# EAGLE schematic LAUNCHXL-F28069_B_1400922 (EAGLE 6.5.0)

## Sheet 1 of 7
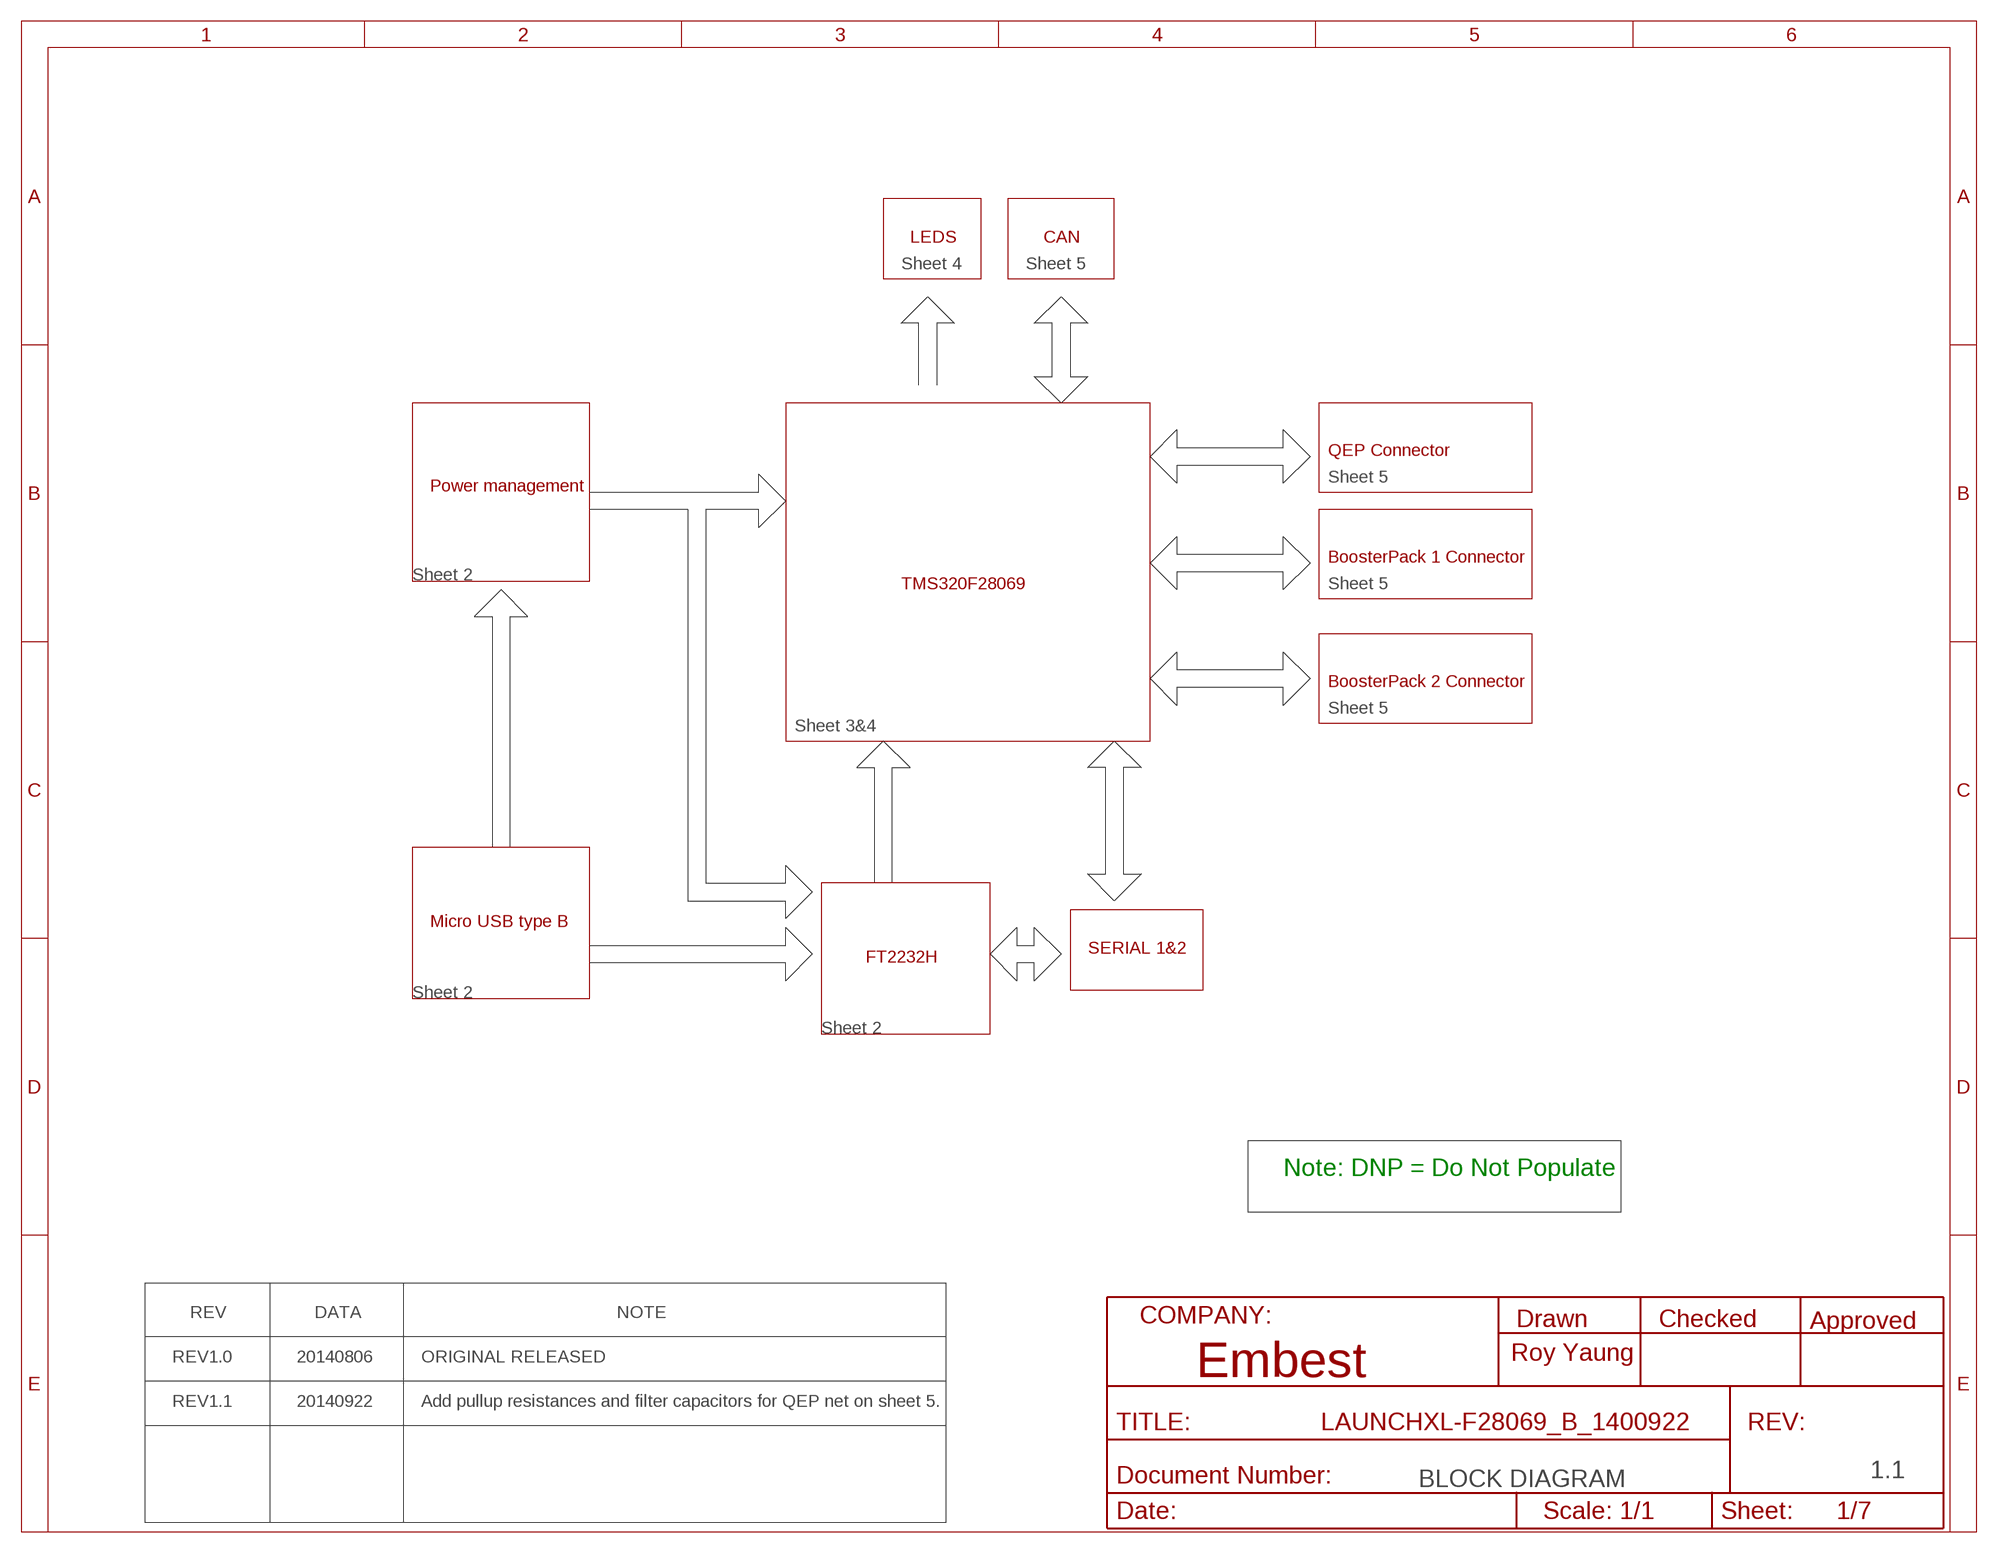
[diagram p0: schematic, sheet 1]

### Notes on the sheet
- LEDS | CAN
- Sheet 4 | Sheet 5
- QEP Connector
- Sheet 5
- Power management
- BoosterPack 1 Connector
- Sheet 2
- TMS320F28069 | Sheet 5
- BoosterPack 2 Connector
- Sheet 5
- Sheet 3&4
- Micro USB type B
- SERIAL 1&2
- FT2232H
- Sheet 2
- Sheet 2
- Note: DNP = Do Not Populate
- REV | DATA | NOTE
- REV1.0 | 20140806 | ORIGINAL RELEASED | Roy Yaung
- REV1.1 | 20140922 | Add pullup resistances and filter capacitors for QEP net on sheet 5.
- 1.1
- BLOCK DIAGRAM

## Sheet 2 of 7
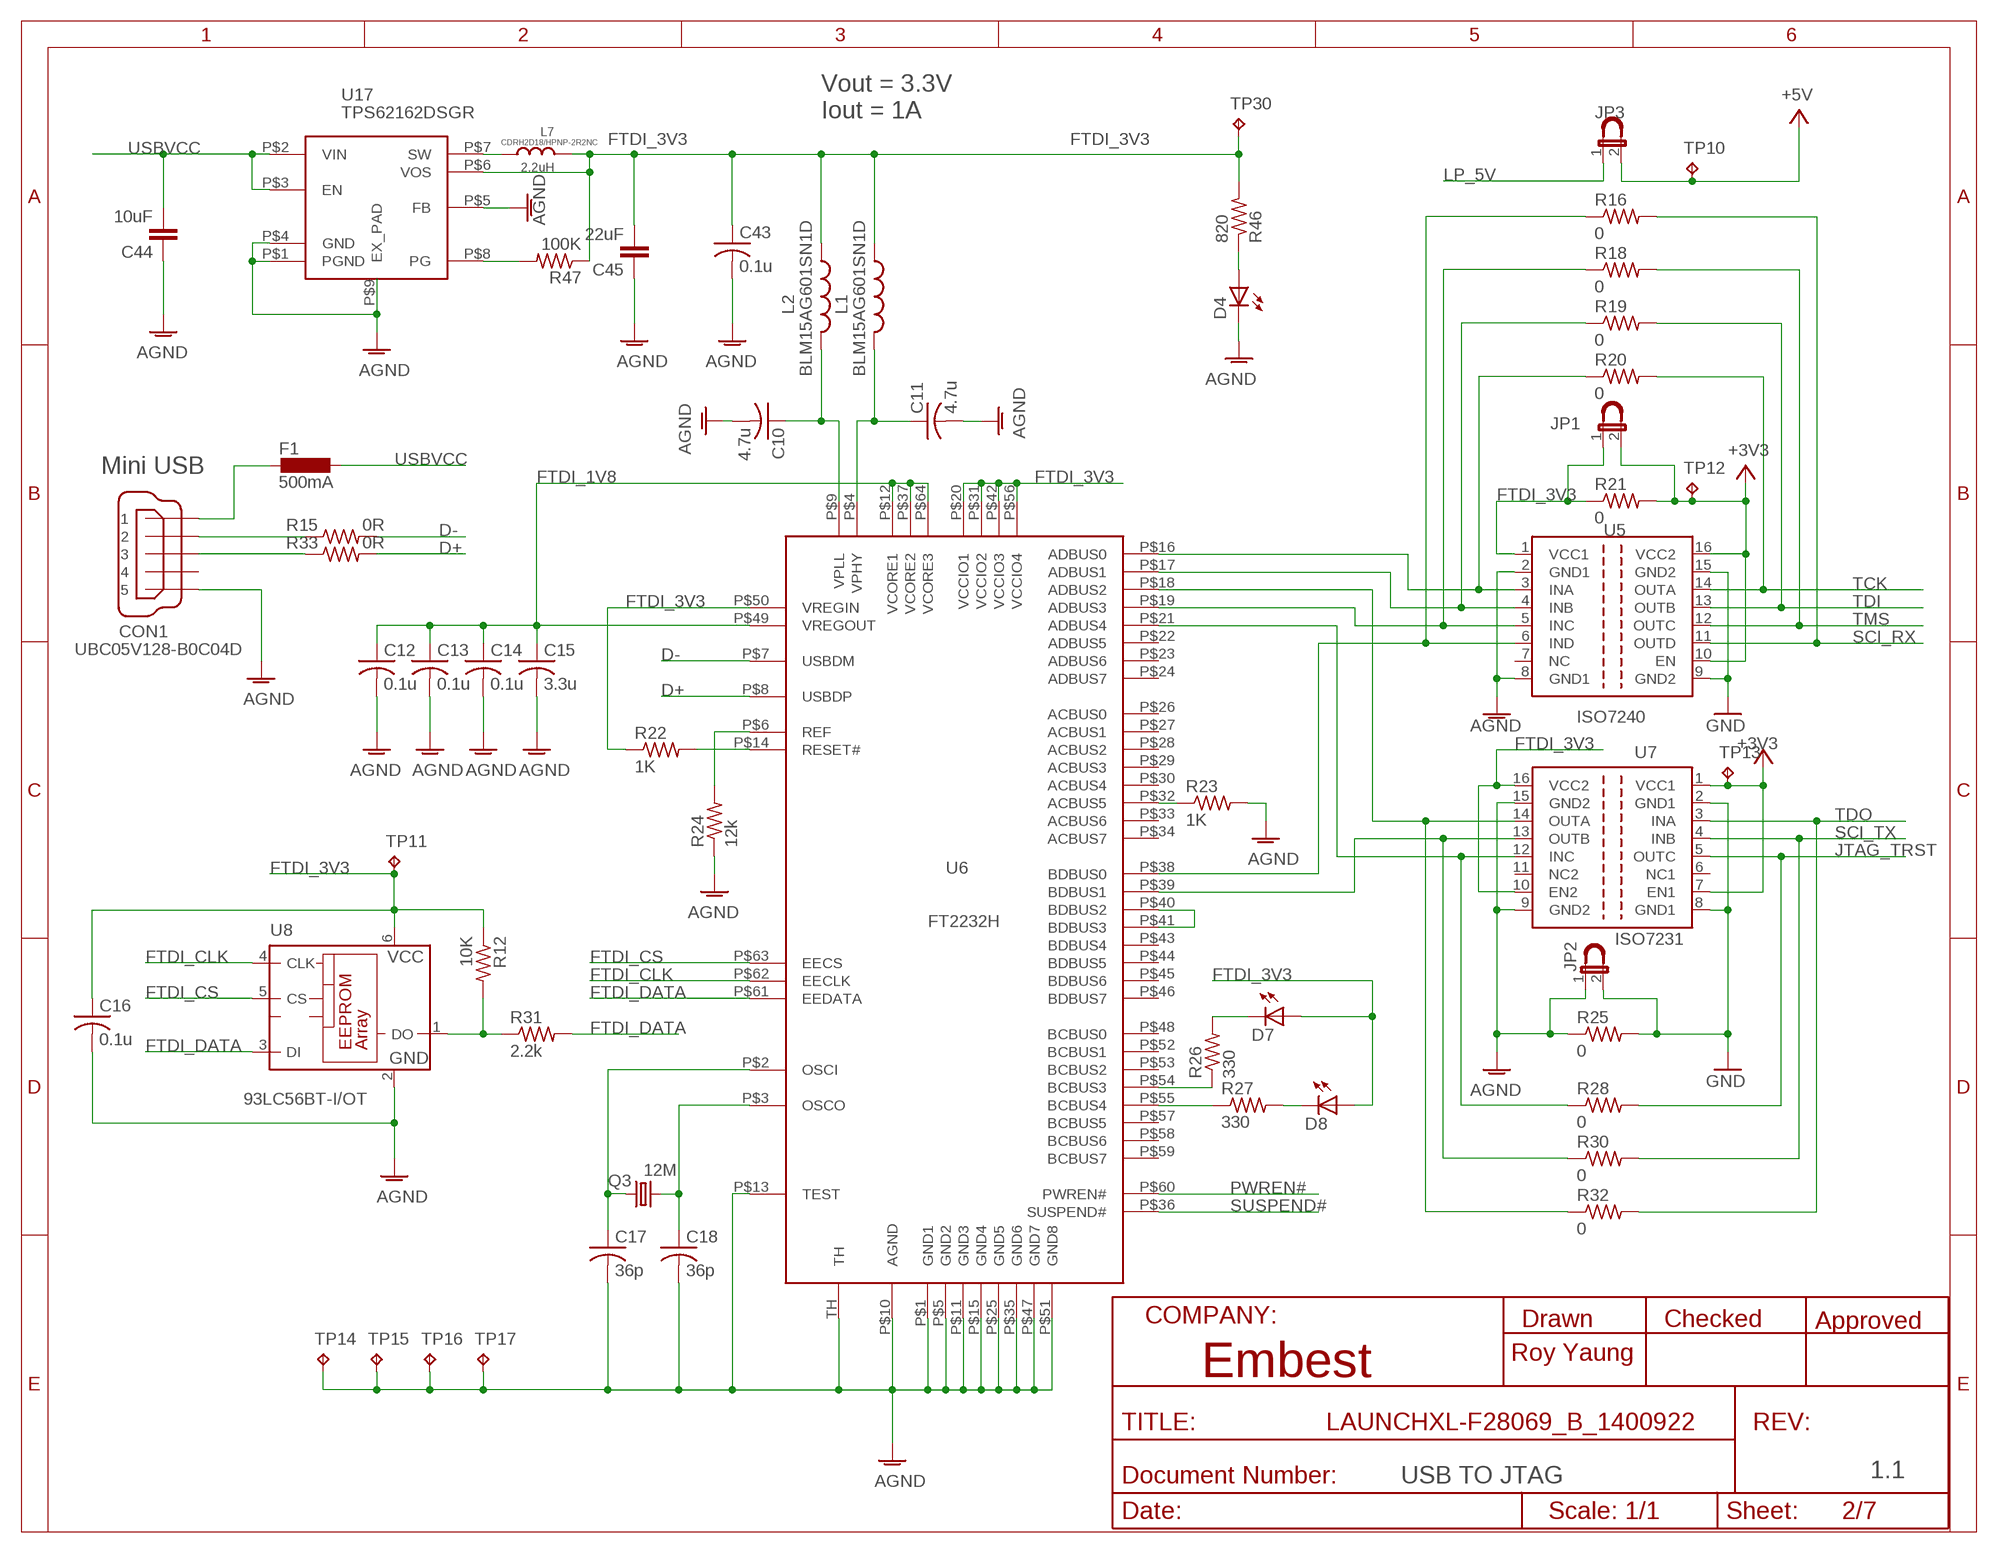
[diagram p1: schematic, sheet 2]

### Parts
C10  4.7u  C-USC0402  [C0402]
C11  4.7u  C-USC0402  [C0402]
C12  0.1u  C-USC0402  [C0402]
C13  0.1u  C-USC0402  [C0402]
C14  0.1u  C-USC0402  [C0402]
C15  3.3u  C-USC0402  [C0402]
C16  0.1u  C-USC0402  [C0402]
C17  36p  C-USC0402  [C0402]
C18  36p  C-USC0402  [C0402]
C43  0.1u  C-USC0402  [C0402]
C44  10uF  SPARKFUN_CAP1210  [SPARKFUN_1210]
C45  22uF  SPARKFUN_CAP1210  [SPARKFUN_1210]
CON1  UBC05V128-B0C04D  MINI-USB-32005-201  [32005-201]
D4  LEDCHIP-LED0603  [CHIP-LED0603]
D7  LEDCHIP-LED0603  [CHIP-LED0603]
D8  LEDCHIP-LED0603  [CHIP-LED0603]
F1  500mA  L-EUL1812  [L1812]
JP1  JP1ENORM  [JP1]
JP2  JP1ENORM  [JP1]
JP3  JP1ENORM  [JP1]
L1  BLM15AG601SN1D  L-US0402  [R0402]
L2  BLM15AG601SN1D  L-US0402  [R0402]
L7  2.2uH  VLF4012A`  [INDUCT-3.2*3.2]
Q3  12M  CRYSTALHC49UP  [HC49UP]
R12  10K  R-US_R0402  [R0402]
R15  0R  R-US_R0402  [R0402]
R16  0  R-US_R1206  [R1206]
R18  0  R-US_R1206  [R1206]
R19  0  R-US_R1206  [R1206]
R20  0  R-US_R1206  [R1206]
R21  0  R-US_R1206  [R1206]
R22  1K  R-US_R0402  [R0402]
R23  1K  R-US_R0402  [R0402]
R24  12k  R-US_R0402  [R0402]
R25  0  R-US_R1206  [R1206]
R26  330  R-US_R0402  [R0402]
R27  330  R-US_R0402  [R0402]
R28  0  R-US_R1206  [R1206]
R30  0  R-US_R1206  [R1206]
R31  2.2k  R-US_R0402  [R0402]
R32  0  R-US_R1206  [R1206]
R33  0R  R-US_R0402  [R0402]
R46  820  R-US_R0402  [R0402]
R47  100K  R-US_R0402  [R0402]
TP10  TESTPAD_TPB1,27  [TESTPAD_B1,27]
TP11  TESTPAD_TPB1,27  [TESTPAD_B1,27]
TP12  TESTPAD_TPB1,27  [TESTPAD_B1,27]
TP13  TESTPAD_TPB1,27  [TESTPAD_B1,27]
TP14  TESTPAD_TPB1,27  [TESTPAD_B1,27]
TP15  TESTPAD_TPB1,27  [TESTPAD_B1,27]
TP16  TESTPAD_TPB1,27  [TESTPAD_B1,27]
TP17  TESTPAD_TPB1,27  [TESTPAD_B1,27]
TP30  TESTPAD_TPB1,27  [TESTPAD_B1,27]
U5  ISO7240  [SO-16DW]
U6  FT2232H  [QFN64]
U7  ISO7231  [SO-16DW]
U8  93LC56BT-I/OT  93  [SOT23-6]
U17  TPS62162DSGR  [TI_DSG8]
U$9  ROY_JUMPER  [ROY_JUMPER]
U$10  ROY_JUMPER  [ROY_JUMPER]
U$11  ROY_JUMPER  [ROY_JUMPER]

### Nets
+3V3: JP1.2 R21.2 TP12.TP TP13.TP U5.10(EN) U5.16(VCC2) U7.1(VCC1) U7.7(EN1) ; also sheet 3,4,5,6,7
+5V: JP3.2 TP10.TP ; also sheet 5
AGND: C10.2 C11.2 C12.2 C13.2 C14.2 C15.2 C16.2 C17.2 C18.2 C43.2 C44.1 C45.1 CON1.5 D4.C JP2.1 R23.2 R24.1 R25.1 TP14.TP TP15.TP TP16.TP TP17.TP U5.2(GND1) U5.8(GND1) U6.P$1(GND1) U6.P$5(GND2) U6.P$10(AGND) U6.P$11(GND3) U6.P$13(TEST) U6.P$15(GND4) U6.P$25(GND5) U6.P$35(GND6) U6.P$47(GND7) U6.P$51(GND8) U6.TH U7.9(GND2) U7.15(GND2) U8.2(GND) U17.P$1(PGND) U17.P$4(GND) U17.P$5(FB) U17.P$9(EX_PAD)
D+: R33.2 U6.P$8(USBDP)
D-: R15.2 U6.P$7(USBDM)
FTDI_1V8: C12.1 C13.1 C14.1 C15.1 U6.P$12(VCORE1) U6.P$37(VCORE2) U6.P$49(VREGOUT) U6.P$64(VCORE3)
FTDI_3V3: C16.1 C43.1 C45.2 D7.A D8.A JP1.1 L1.1 L2.1 L7.P$1 R12.1 R21.1 R22.1 R46.2 R47.1 TP11.TP TP30.TP U5.1(VCC1) U6.P$20(VCCIO1) U6.P$31(VCCIO2) U6.P$42(VCCIO3) U6.P$50(VREGIN) U6.P$56(VCCIO4) U7.10(EN2) U7.16(VCC2) U8.6(VCC) U17.P$6(VOS)
FTDI_CLK: U6.P$62(EECLK) U8.4(CLK)
FTDI_CS: U6.P$63(EECS) U8.5(CS)
FTDI_DATA: R31.2 U6.P$61(EEDATA) U8.3(DI)
GND: JP2.2 R25.2 U5.9(GND2) U5.15(GND2) U7.2(GND1) U7.8(GND1) ; also sheet 3,4,5,6,7
JTAG_TRST: R28.2 U7.5(OUTC) ; also sheet 3
LP_5V: JP3.1 ; also sheet 7
N$1: R20.1 U5.3(INA) U6.P$16(ADBUS0)
N$2: C17.1 Q3.1 U6.P$2(OSCI)
N$4: R19.1 U5.4(INB) U6.P$17(ADBUS1)
N$5: R32.1 U6.P$18(ADBUS2) U7.14(OUTA)
N$6: R18.1 U5.5(INC) U6.P$19(ADBUS3)
N$7: C18.1 Q3.2 U6.P$3(OSCO)
N$12: R12.2 R31.1 U8.1(DO)
N$13: R28.1 U6.P$21(ADBUS4) U7.12(INC)
N$14: R23.1 U6.P$32(ACBUS5)
N$15: U6.P$40(BDBUS2) U6.P$41(BDBUS3)
N$16: R16.1 U5.6(IND) U6.P$38(BDBUS0)
N$17: R24.2 U6.P$6(REF)
N$19: R26.1 U6.P$54(BCBUS3)
N$20: C11.1 L1.2 U6.P$4(VPHY)
N$21: R30.1 U6.P$39(BDBUS1) U7.13(OUTB)
N$22: R27.1 U6.P$55(BCBUS4)
N$23: D7.C R26.2
N$24: D8.C R27.2
N$26: C10.1 L2.2 U6.P$9(VPLL)
N$34: R22.2 U6.P$14(RESET#)
N$38: CON1.2 R15.1
N$39: CON1.3 R33.1
N$40: D4.A R46.1
N$43: R47.2 U17.P$8(PG)
N$51: L7.P$2 U17.P$7(SW)
PWREN#: U6.P$60(PWREN#)
SCI_RX: R16.2 U5.11(OUTD) ; also sheet 6
SCI_TX: R30.2 U7.4(INB) ; also sheet 6
SUSPEND#: U6.P$36(SUSPEND#)
TCK: R20.2 U5.14(OUTA) ; also sheet 3
TDI: R19.2 U5.13(OUTB) ; also sheet 3
TDO: R32.2 U7.3(INA) ; also sheet 3
TMS: R18.2 U5.12(OUTC) ; also sheet 3
USBVCC: C44.2 F1.1 U17.P$2(VIN) U17.P$3(EN)
XUSB: CON1.1 F1.2
Unconnected: CON1.4 U5.7(NC) U6.P$22(ADBUS5) U6.P$23(ADBUS6) U6.P$24(ADBUS7) U6.P$26(ACBUS0) U6.P$27(ACBUS1) U6.P$28(ACBUS2) U6.P$29(ACBUS3) U6.P$30(ACBUS4) U6.P$33(ACBUS6) U6.P$34(ACBUS7) U6.P$43(BDBUS4) U6.P$44(BDBUS5) U6.P$45(BDBUS6) U6.P$46(BDBUS7) U6.P$48(BCBUS0) U6.P$52(BCBUS1) U6.P$53(BCBUS2) U6.P$57(BCBUS5) U6.P$58(BCBUS6) U6.P$59(BCBUS7) U7.6(NC1) U7.11(NC2)

### Notes on the sheet
- Vout = 3.3V
- Iout = 1A
- CDRH2D18/HPNP-2R2NC
- Mini USB
- Roy Yaung
- USB TO JTAG | 1.1

## Sheet 3 of 7
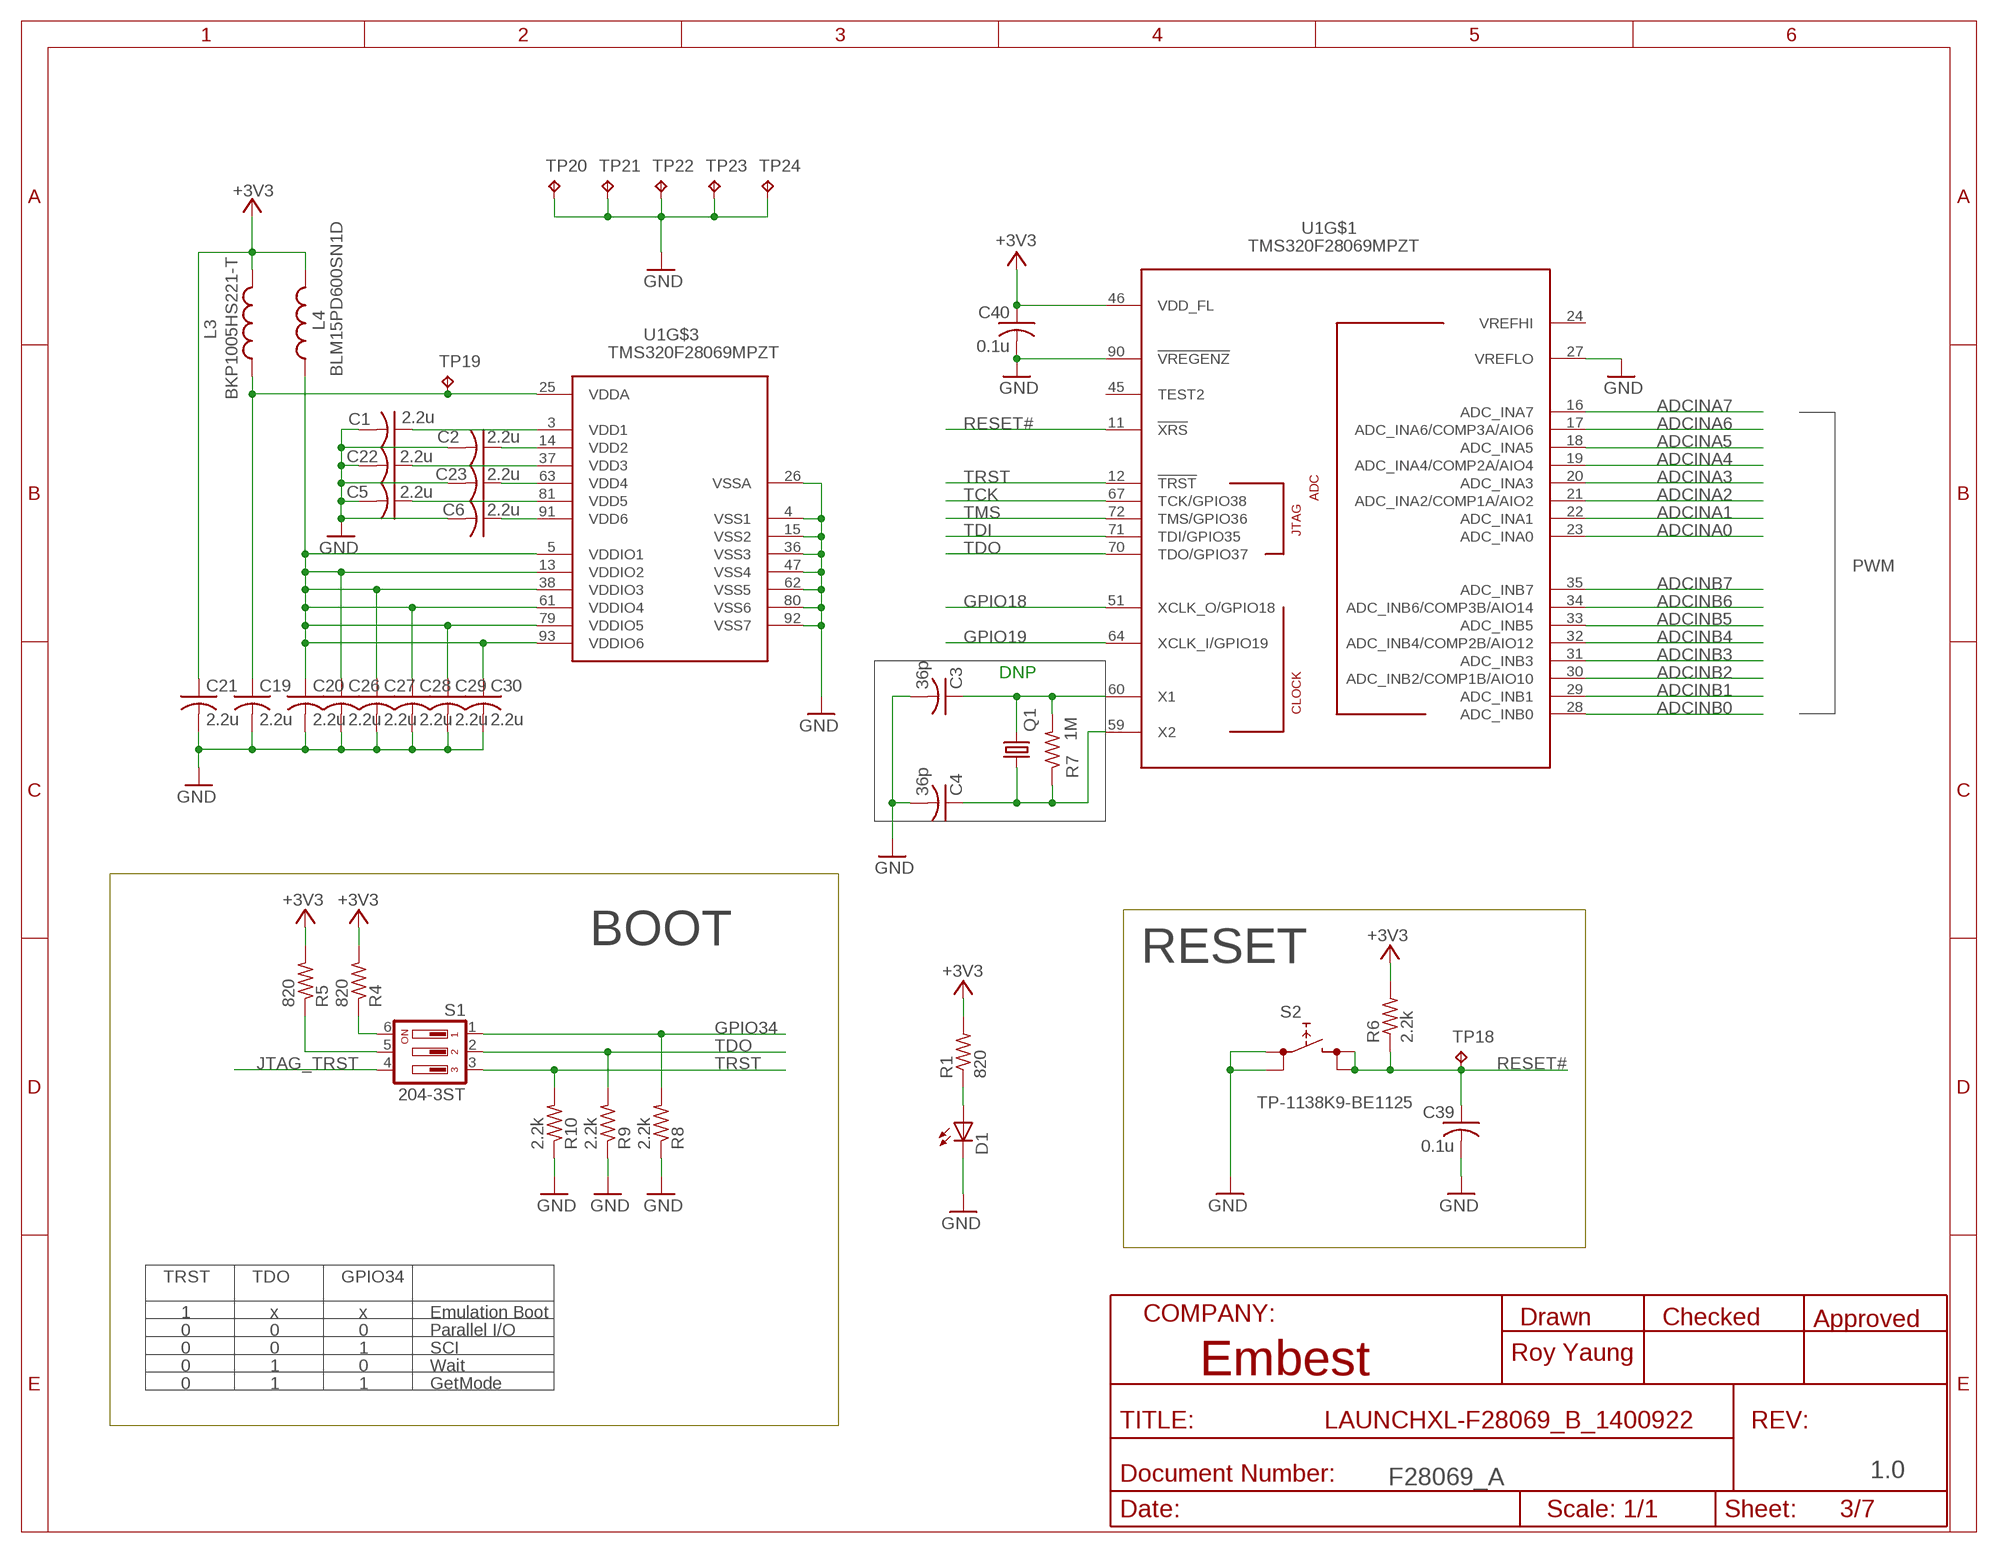
[diagram p2: schematic, sheet 3]

### Parts
C1  2.2u  C-USC0402  [C0402]
C2  2.2u  C-USC0402  [C0402]
C3  36p  C-USC0402  [C0402]
C4  36p  C-USC0402  [C0402]
C5  2.2u  C-USC0402  [C0402]
C6  2.2u  C-USC0402  [C0402]
C19  2.2u  C-USC0402  [C0402]
C20  2.2u  C-USC0402  [C0402]
C21  2.2u  C-USC0402  [C0402]
C22  2.2u  C-USC0402  [C0402]
C23  2.2u  C-USC0402  [C0402]
C26  2.2u  C-USC0402  [C0402]
C27  2.2u  C-USC0402  [C0402]
C28  2.2u  C-USC0402  [C0402]
C29  2.2u  C-USC0402  [C0402]
C30  2.2u  C-USC0402  [C0402]
C39  0.1u  C-USC0402  [C0402]
C40  0.1u  C-USC0402  [C0402]
D1  LEDCHIP-LED0603  [CHIP-LED0603]
L3  BKP1005HS221-T  L-US0402  [R0402]
L4  BLM15PD600SN1D  L-US0402  [R0402]
Q1  CRYSTALHC49S  [HC49/S]
R1  820  R-US_R0402  [R0402]
R4  820  R-US_R0402  [R0402]
R5  820  R-US_R0402  [R0402]
R6  2.2k  R-US_R0402  [R0402]
R7  1M  R-US_R0402  [R0402]
R8  2.2k  R-US_R0402  [R0402]
R9  2.2k  R-US_R0402  [R0402]
R10  2.2k  R-US_R0402  [R0402]
S1  204-3ST  219-03  [CTS-219-03]
S2  TP-1138K9-BE1125  FSMJSMA  [FSMJSMA]
TP18  TESTPAD_TPB1,27  [TESTPAD_B1,27]
TP19  TESTPAD_TPB1,27  [TESTPAD_B1,27]
TP20  TESTPAD_TPB1,27  [TESTPAD_B1,27]
TP21  TESTPAD_TPB1,27  [TESTPAD_B1,27]
TP22  TESTPAD_TPB1,27  [TESTPAD_B1,27]
TP23  TESTPAD_TPB1,27  [TESTPAD_B1,27]
TP24  TESTPAD_TPB1,27  [TESTPAD_B1,27]
U1  TMS320F28069MPZT  TMS320F28069PZSR  [PQFP100]

### Nets
+3V3: C21.1 C40.1 L3.2 L4.2 R1.2 R4.2 R5.2 R6.2 U1.46(VDD_FL) ; also sheet 2,4,5,6,7
ADCINA0: U1.23(ADC_INA0) ; also sheet 5
ADCINA1: U1.22(ADC_INA1) ; also sheet 5
ADCINA2: U1.21(ADC_INA2/COMP1A/AIO2) ; also sheet 5
ADCINA3: U1.20(ADC_INA3) ; also sheet 5
ADCINA4: U1.19(ADC_INA4/COMP2A/AIO4) ; also sheet 5
ADCINA5: U1.18(ADC_INA5) ; also sheet 5
ADCINA6: U1.17(ADC_INA6/COMP3A/AIO6) ; also sheet 5
ADCINA7: U1.16(ADC_INA7) ; also sheet 5
ADCINB0: U1.28(ADC_INB0) ; also sheet 5
ADCINB1: U1.29(ADC_INB1) ; also sheet 5
ADCINB2: U1.30(ADC_INB2/COMP1B/AIO10) ; also sheet 5
ADCINB3: U1.31(ADC_INB3) ; also sheet 5
ADCINB4: U1.32(ADC_INB4/COMP2B/AIO12) ; also sheet 5
ADCINB5: U1.33(ADC_INB5) ; also sheet 5
ADCINB6: U1.34(ADC_INB6/COMP3B/AIO14) ; also sheet 5
ADCINB7: U1.35(ADC_INB7) ; also sheet 5
GND: C1.2 C2.2 C3.2 C4.2 C5.2 C6.2 C19.2 C20.2 C21.2 C22.2 C23.2 C26.2 C27.2 C28.2 C29.2 C30.2 C39.2 C40.2 D1.C R8.1 R9.1 R10.1 S2.P$1 S2.P$2 TP20.TP TP21.TP TP22.TP TP23.TP TP24.TP U1.4(VSS1) U1.15(VSS2) U1.26(VSSA) U1.27(VREFLO) U1.36(VSS3) U1.47(VSS4) U1.62(VSS5) U1.80(VSS6) U1.90(!VREGENZ) U1.92(VSS7) ; also sheet 2,4,5,6,7
GPIO18: U1.51(XCLK_O/GPIO18) ; also sheet 5
GPIO19: U1.64(XCLK_I/GPIO19) ; also sheet 5
GPIO34: R8.2 S1.1 ; also sheet 4
JTAG_TRST: S1.4 ; also sheet 2
N$8: C3.1 Q1.2 R7.2 U1.60(X1)
N$9: R4.1 S1.6
N$10: R5.1 S1.5
N$11: C4.1 Q1.1 R7.1 U1.59(X2)
N$27: D1.A R1.1
N$28: C1.1 U1.3(VDD1)
N$29: C2.1 U1.14(VDD2)
N$30: C22.1 U1.37(VDD3)
N$31: C23.1 U1.63(VDD4)
N$35: C5.1 U1.81(VDD5)
N$36: C6.1 U1.91(VDD6)
RESET#: C39.1 R6.1 S2.P$3 S2.P$4 TP18.TP U1.11(!XRS) ; also sheet 5
TCK: U1.67(TCK/GPIO38) ; also sheet 2
TDI: U1.71(TDI/GPIO35) ; also sheet 2
TDO: R9.2 S1.2 U1.70(TDO/GPIO37) ; also sheet 2
TMS: U1.72(TMS/GPIO36) ; also sheet 2
TRST: R10.2 S1.3 U1.12(!TRST)
VDDA: C19.1 L3.1 TP19.TP U1.25(VDDA)
VDDIO: C20.1 C26.1 C27.1 C28.1 C29.1 C30.1 L4.1 U1.5(VDDIO1) U1.13(VDDIO2) U1.38(VDDIO3) U1.61(VDDIO4) U1.79(VDDIO5) U1.93(VDDIO6)
Unconnected: U1.24(VREFHI) U1.45(TEST2)

### Notes on the sheet
- PWM
- DNP
- BOOT
- RESET
- TRST | TDO | GPIO34
- 1 | x | x | Emulation Boot
- 0 | 0 | 0 | Parallel I/O
- 0 | 0 | 1 | SCI
- Roy Yaung
- 0 | 1 | 0 | Wait
- 0 | 1 | 1 | GetMode
- 1.0
- F28069_A

## Sheet 4 of 7
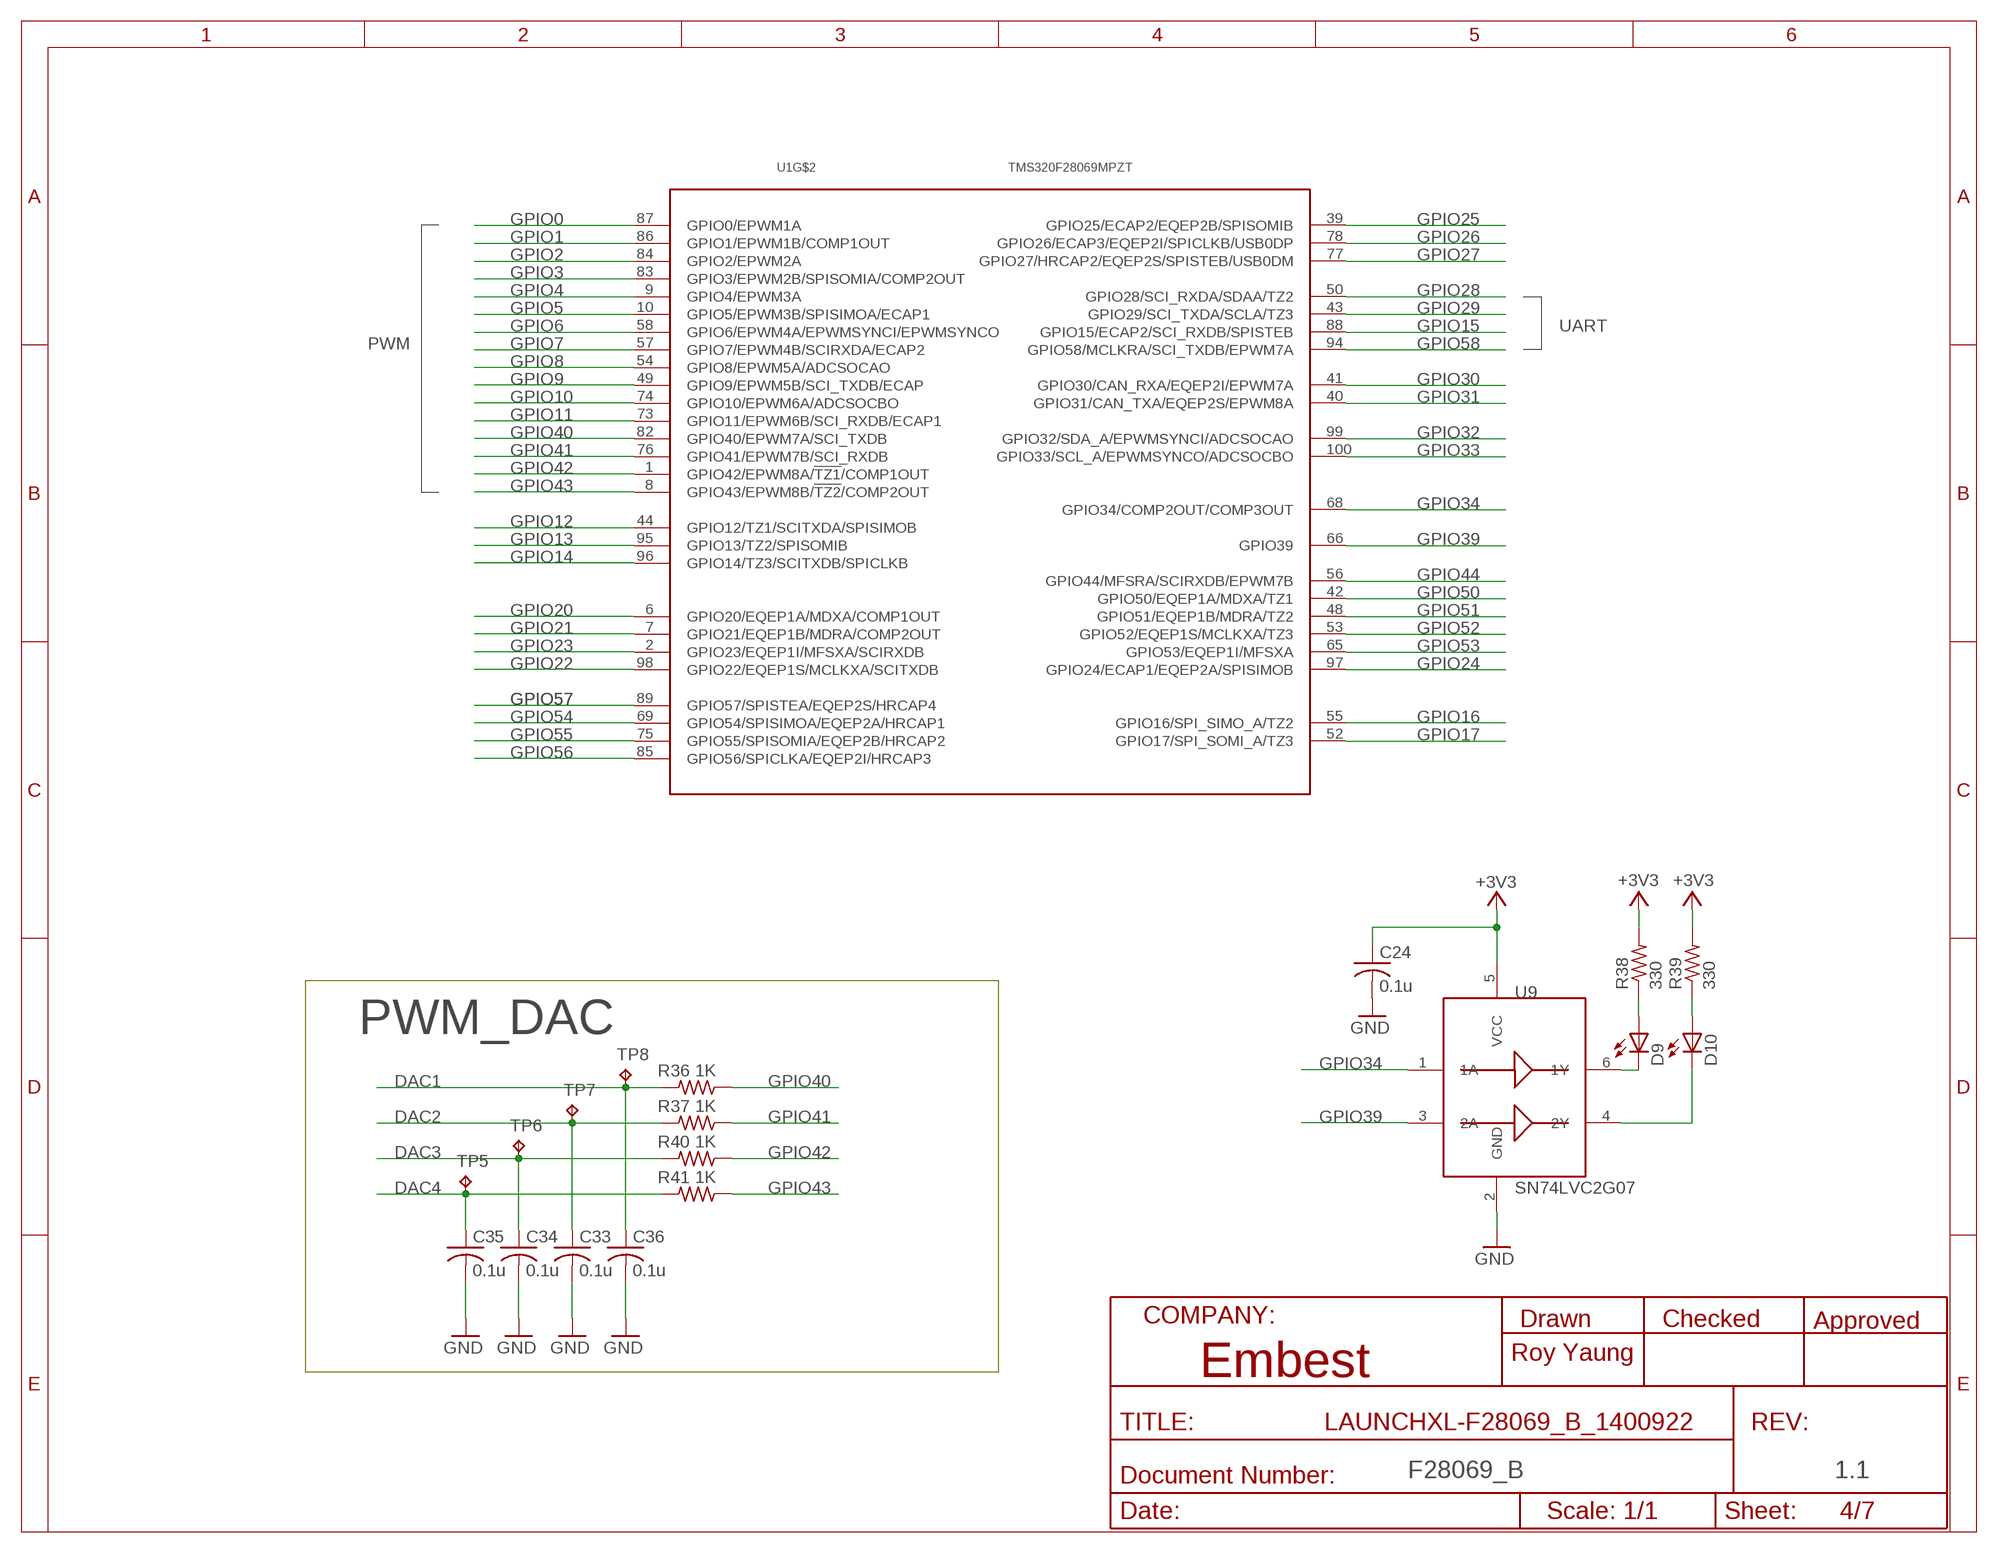
[diagram p3: schematic, sheet 4]

### Parts
C24  0.1u  C-USC0402  [C0402]
C33  0.1u  C-USC0402  [C0402]
C34  0.1u  C-USC0402  [C0402]
C35  0.1u  C-USC0402  [C0402]
C36  0.1u  C-USC0402  [C0402]
D9  LEDCHIP-LED0603  [CHIP-LED0603]
D10  LEDCHIP-LED0603  [CHIP-LED0603]
R36  1K  R-US_R0402  [R0402]
R37  1K  R-US_R0402  [R0402]
R38  330  R-US_R0402  [R0402]
R39  330  R-US_R0402  [R0402]
R40  1K  R-US_R0402  [R0402]
R41  1K  R-US_R0402  [R0402]
TP5  TESTPAD_TPB1,27  [TESTPAD_B1,27]
TP6  TESTPAD_TPB1,27  [TESTPAD_B1,27]
TP7  TESTPAD_TPB1,27  [TESTPAD_B1,27]
TP8  TESTPAD_TPB1,27  [TESTPAD_B1,27]
U9  SN74LVC2G07  [SOT23-6-DBV]

### Nets
+3V3: C24.1 R38.2 R39.2 U9.5(VCC) ; also sheet 2,3,5,6,7
DAC1: C36.1 R36.2 TP8.TP ; also sheet 5
DAC2: C33.1 R37.2 TP7.TP ; also sheet 5
DAC3: C34.1 R40.2 TP6.TP ; also sheet 5
DAC4: C35.1 R41.2 TP5.TP ; also sheet 5
GND: C24.2 C33.2 C34.2 C35.2 C36.2 U9.2(GND) ; also sheet 2,3,5,6,7
GPIO0: U1.87(GPIO0/EPWM1A) ; also sheet 5
GPIO1: U1.86(GPIO1/EPWM1B/COMP1OUT) ; also sheet 5
GPIO2: U1.84(GPIO2/EPWM2A) ; also sheet 5
GPIO3: U1.83(GPIO3/EPWM2B/SPISOMIA/COMP2OUT) ; also sheet 5
GPIO4: U1.9(GPIO4/EPWM3A) ; also sheet 5
GPIO5: U1.10(GPIO5/EPWM3B/SPISIMOA/ECAP1) ; also sheet 5
GPIO6: U1.58(GPIO6/EPWM4A/EPWMSYNCI/EPWMSYNCO) ; also sheet 5
GPIO7: U1.57(GPIO7/EPWM4B/SCIRXDA/ECAP2) ; also sheet 5
GPIO8: U1.54(GPIO8/EPWM5A/ADCSOCAO) ; also sheet 5
GPIO9: U1.49(GPIO9/EPWM5B/SCI_TXDB/ECAP) ; also sheet 5
GPIO10: U1.74(GPIO10/EPWM6A/ADCSOCBO) ; also sheet 5
GPIO11: U1.73(GPIO11/EPWM6B/SCI_RXDB/ECAP1) ; also sheet 5
GPIO12: U1.44(GPIO12/TZ1/SCITXDA/SPISIMOB) ; also sheet 5
GPIO13: U1.95(GPIO13/TZ2/SPISOMIB) ; also sheet 5
GPIO14: U1.96(GPIO14/TZ3/SCITXDB/SPICLKB) ; also sheet 5
GPIO15: U1.88(GPIO15/ECAP2/SCI_RXDB/SPISTEB) ; also sheet 6
GPIO16: U1.55(GPIO16/SPI_SIMO_A/TZ2) ; also sheet 5
GPIO17: U1.52(GPIO17/SPI_SOMI_A/TZ3) ; also sheet 5
GPIO20: U1.6(GPIO20/EQEP1A/MDXA/COMP1OUT) ; also sheet 5
GPIO21: U1.7(GPIO21/EQEP1B/MDRA/COMP2OUT) ; also sheet 5
GPIO22: U1.98(GPIO22/EQEP1S/MCLKXA/SCITXDB) ; also sheet 5
GPIO23: U1.2(GPIO23/EQEP1I/MFSXA/SCIRXDB) ; also sheet 5
GPIO24: U1.97(GPIO24/ECAP1/EQEP2A/SPISIMOB) ; also sheet 5
GPIO25: U1.39(GPIO25/ECAP2/EQEP2B/SPISOMIB) ; also sheet 5
GPIO26: U1.78(GPIO26/ECAP3/EQEP2I/SPICLKB/USB0DP) ; also sheet 5
GPIO27: U1.77(GPIO27/HRCAP2/EQEP2S/SPISTEB/USB0DM) ; also sheet 5
GPIO28: U1.50(GPIO28/SCI_RXDA/SDAA/TZ2) ; also sheet 6
GPIO29: U1.43(GPIO29/SCI_TXDA/SCLA/TZ3) ; also sheet 6
GPIO30: U1.41(GPIO30/CAN_RXA/EQEP2I/EPWM7A) ; also sheet 5
GPIO31: U1.40(GPIO31/CAN_TXA/EQEP2S/EPWM8A) ; also sheet 5
GPIO32: U1.99(GPIO32/SDA_A/EPWMSYNCI/ADCSOCAO) ; also sheet 5
GPIO33: U1.100(GPIO33/SCL_A/EPWMSYNCO/ADCSOCBO) ; also sheet 5
GPIO34: U1.68(GPIO34/COMP2OUT/COMP3OUT) U9.1(1A) ; also sheet 3
GPIO39: U1.66(GPIO39) U9.3(2A)
GPIO40: R36.1 U1.82(GPIO40/EPWM7A/SCI_TXDB)
GPIO41: R37.1 U1.76(GPIO41/EPWM7B/SCI_RXDB)
GPIO42: R40.1 U1.1(GPIO42/EPWM8A/!TZ1!/COMP1OUT)
GPIO43: R41.1 U1.8(GPIO43/EPWM8B/!TZ2!/COMP2OUT)
GPIO44: U1.56(GPIO44/MFSRA/SCIRXDB/EPWM7B) ; also sheet 5
GPIO50: U1.42(GPIO50/EQEP1A/MDXA/TZ1) ; also sheet 5
GPIO51: U1.48(GPIO51/EQEP1B/MDRA/TZ2) ; also sheet 5
GPIO52: U1.53(GPIO52/EQEP1S/MCLKXA/TZ3) ; also sheet 5
GPIO53: U1.65(GPIO53/EQEP1I/MFSXA) ; also sheet 5
GPIO54: U1.69(GPIO54/SPISIMOA/EQEP2A/HRCAP1) ; also sheet 5
GPIO55: U1.75(GPIO55/SPISOMIA/EQEP2B/HRCAP2) ; also sheet 5
GPIO56: U1.85(GPIO56/SPICLKA/EQEP2I/HRCAP3) ; also sheet 5
GPIO57: U1.89(GPIO57/SPISTEA/EQEP2S/HRCAP4)
GPIO58: U1.94(GPIO58/MCLKRA/SCI_TXDB/EPWM7A) ; also sheet 6
N$47: D9.C U9.6(1Y)
N$49: D9.A R38.1
N$50: D10.A R39.1
N$59: D10.C U9.4(2Y)

### Notes on the sheet
- UART
- PWM
- PWM_DAC
- Roy Yaung
- F28069_B | 1.1

## Sheet 5 of 7
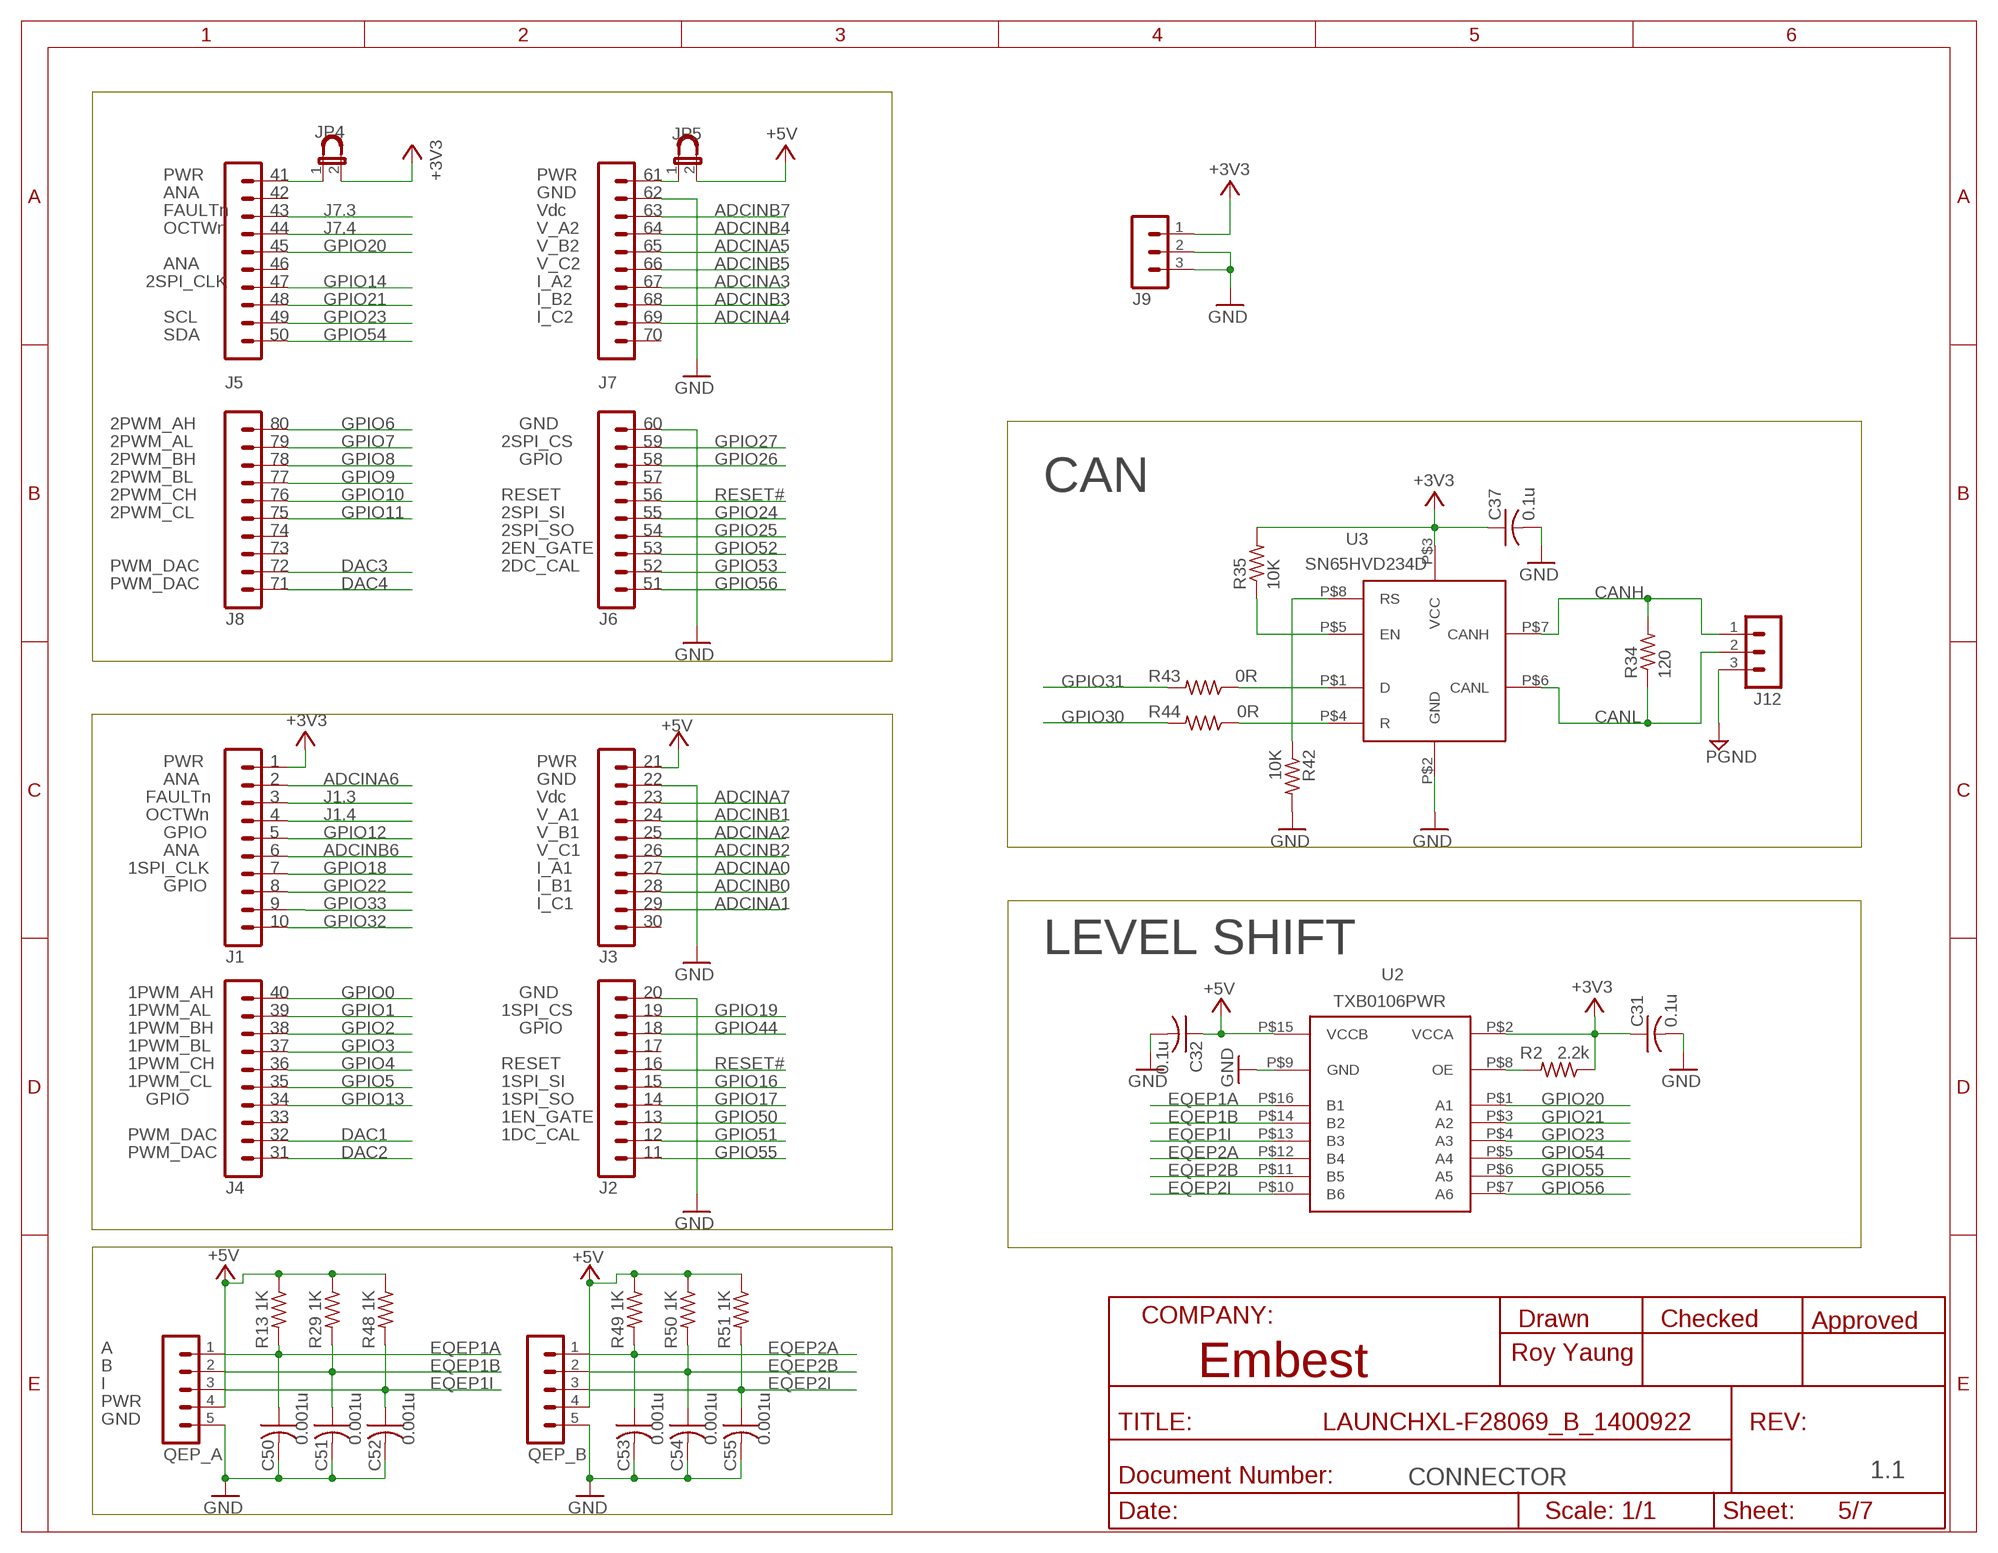
[diagram p4: schematic, sheet 5]

### Parts
C31  0.1u  C-USC0402  [C0402]
C32  0.1u  C-USC0402  [C0402]
C37  0.1u  C-USC0402  [C0402]
C50  0.001u  C-USC0402  [C0402]
C51  0.001u  C-USC0402  [C0402]
C52  0.001u  C-USC0402  [C0402]
C53  0.001u  C-USC0402  [C0402]
C54  0.001u  C-USC0402  [C0402]
C55  0.001u  C-USC0402  [C0402]
J1  MA10-1  [MA10-1]
J2  MA10-1  [MA10-1]
J3  MA10-1  [MA10-1]
J4  MA10-1  [MA10-1]
J5  MA10-1  [MA10-1]
J6  MA10-1  [MA10-1]
J7  MA10-1  [MA10-1]
J8  MA10-1  [MA10-1]
J9  CON-LSTB_MA03-1  [CON-LSTB_MA03-1]
J12  MA03-1  [MA03-1]
JP4  JP1ENORM  [JP1]
JP5  JP1ENORM  [JP1]
QEP_A  MA05-1  [MA05-1]
QEP_B  MA05-1  [MA05-1]
R2  2.2k  R-US_R0402  [R0402]
R13  1K  R-US_R0402  [R0402]
R29  1K  R-US_R0402  [R0402]
R34  120  R-US_R0402  [R0402]
R35  10K  R-US_R0402  [R0402]
R42  10K  R-US_R0402  [R0402]
R43  0R  R-US_R0402  [R0402]
R44  0R  R-US_R0402  [R0402]
R48  1K  R-US_R0402  [R0402]
R49  1K  R-US_R0402  [R0402]
R50  1K  R-US_R0402  [R0402]
R51  1K  R-US_R0402  [R0402]
U2  TXB0106PWR  [TSSOP16-PW]
U3  SN65HVD234D  [SOIC8-PDSO]
U$12  ROY_JUMPER  [ROY_JUMPER]
U$13  ROY_JUMPER  [ROY_JUMPER]

### Nets
+3V3: C31.1 C37.1 J1.1 J9.1 JP4.2 R2.1 R35.2 U2.P$2(VCCA) U3.P$3(VCC) ; also sheet 2,3,4,6,7
+5V: C32.1 J3.1 JP5.2 QEP_A.4 QEP_B.4 R13.1 R29.1 R48.1 R49.1 R50.1 R51.1 U2.P$15(VCCB) ; also sheet 2
ADCINA0: J3.7 ; also sheet 3
ADCINA1: J3.9 ; also sheet 3
ADCINA2: J3.5 ; also sheet 3
ADCINA3: J7.7 ; also sheet 3
ADCINA4: J7.9 ; also sheet 3
ADCINA5: J7.5 ; also sheet 3
ADCINA6: J1.2 ; also sheet 3
ADCINA7: J3.3 ; also sheet 3
ADCINB0: J3.8 ; also sheet 3
ADCINB1: J3.4 ; also sheet 3
ADCINB2: J3.6 ; also sheet 3
ADCINB3: J7.8 ; also sheet 3
ADCINB4: J7.4 ; also sheet 3
ADCINB5: J7.6 ; also sheet 3
ADCINB6: J1.6 ; also sheet 3
ADCINB7: J7.3 ; also sheet 3
CANH: J12.1 R34.2 U3.P$7(CANH)
CANL: J12.2 R34.1 U3.P$6(CANL)
DAC1: J4.9 ; also sheet 4
DAC2: J4.10 ; also sheet 4
DAC3: J8.9 ; also sheet 4
DAC4: J8.10 ; also sheet 4
EQEP1A: C50.1 QEP_A.1 R13.2 U2.P$16(B1)
EQEP1B: C51.1 QEP_A.2 R29.2 U2.P$14(B2)
EQEP1I: C52.1 QEP_A.3 R48.2 U2.P$13(B3)
EQEP2A: C53.1 QEP_B.1 R49.2 U2.P$12(B4)
EQEP2B: C54.1 QEP_B.2 R50.2 U2.P$11(B5)
EQEP2I: C55.1 QEP_B.3 R51.2 U2.P$10(B6)
GND: C31.2 C32.2 C37.2 C50.2 C51.2 C52.2 C53.2 C54.2 C55.2 J2.1 J3.2 J6.1 J7.2 J9.2 J9.3 QEP_A.5 QEP_B.5 R42.2 U2.P$9(GND) U3.P$2(GND) ; also sheet 2,3,4,6,7
GPIO0: J4.1 ; also sheet 4
GPIO1: J4.2 ; also sheet 4
GPIO2: J4.3 ; also sheet 4
GPIO3: J4.4 ; also sheet 4
GPIO4: J4.5 ; also sheet 4
GPIO5: J4.6 ; also sheet 4
GPIO6: J8.1 ; also sheet 4
GPIO7: J8.2 ; also sheet 4
GPIO8: J8.3 ; also sheet 4
GPIO9: J8.4 ; also sheet 4
GPIO10: J8.5 ; also sheet 4
GPIO11: J8.6 ; also sheet 4
GPIO12: J1.5 ; also sheet 4
GPIO13: J4.7 ; also sheet 4
GPIO14: J5.7 ; also sheet 4
GPIO16: J2.6 ; also sheet 4
GPIO17: J2.7 ; also sheet 4
GPIO18: J1.7 ; also sheet 3
GPIO19: J2.2 ; also sheet 3
GPIO20: J5.5 U2.P$1(A1) ; also sheet 4
GPIO21: J5.8 U2.P$3(A2) ; also sheet 4
GPIO22: J1.8 ; also sheet 4
GPIO23: J5.9 U2.P$4(A3) ; also sheet 4
GPIO24: J6.6 ; also sheet 4
GPIO25: J6.7 ; also sheet 4
GPIO26: J6.3 ; also sheet 4
GPIO27: J6.2 ; also sheet 4
GPIO30: R44.2 ; also sheet 4
GPIO31: R43.2 ; also sheet 4
GPIO32: J1.10 ; also sheet 4
GPIO33: J1.9 ; also sheet 4
GPIO44: J2.3 ; also sheet 4
GPIO50: J2.8 ; also sheet 4
GPIO51: J2.9 ; also sheet 4
GPIO52: J6.8 ; also sheet 4
GPIO53: J6.9 ; also sheet 4
GPIO54: J5.10 U2.P$5(A4) ; also sheet 4
GPIO55: J2.10 U2.P$6(A5) ; also sheet 4
GPIO56: J6.10 U2.P$7(A6) ; also sheet 4
J1.3: J1.3 ; also sheet 6
J1.4: J1.4 ; also sheet 6
J7.3: J5.3 ; also sheet 6
J7.4: J5.4 ; also sheet 6
N$18: J12.3 ; supply symbol labelled PGND
N$25: J7.1 JP5.1
N$32: J5.1 JP4.1
N$33: R2.2 U2.P$8(OE)
N$44: R35.1 U3.P$5(EN)
N$45: R42.1 U3.P$8(RS)
N$46: R43.1 U3.P$1(D)
N$48: R44.1 U3.P$4(R)
RESET#: J2.5 J6.5 ; also sheet 3
Unconnected: J2.4 J3.10 J4.8 J5.2 J5.6 J6.4 J7.10 J8.7 J8.8

### Notes on the sheet
- PWR | 41 | PWR | 61
- ANA | 42 | GND | 62
- FAULTn | 43 | Vdc | 63
- OCTWn | 44 | V_A2 | 64
- 45 | V_B2 | 65
- ANA | 46 | V_C2 | 66
- 2SPI_CLK | 47 | I_A2 | 67
- 48 | I_B2 | 68
- SCL | 49 | I_C2 | 69
- SDA | 50 | 70
- 2PWM_AH | 80 | GND | 60
- 2PWM_AL | 79 | 2SPI_CS | 59
- 2PWM_BH | 78 | GPIO | 58
- 2PWM_BL | 77 | 57
- CAN
- 2PWM_CH | 76 | RESET | 56
- 2PWM_CL | 75 | 2SPI_SI | 55
- 74 | 2SPI_SO | 54
- 73 | 2EN_GATE | 53
- PWM_DAC | 72 | 2DC_CAL | 52
- PWM_DAC | 71 | 51
- PWR | 1 | PWR | 21
- ANA | 2 | GND | 22
- FAULTn | 3 | Vdc | 23
- OCTWn | 4 | V_A1 | 24
- GPIO | 5 | V_B1 | 25
- ANA | 6 | V_C1 | 26
- 1SPI_CLK | 7 | I_A1 | 27
- GPIO | 8 | I_B1 | 28
- 9 | I_C1 | 29
- 10 | 30
- LEVEL SHIFT
- 1PWM_AH | 40 | GND | 20
- 1PWM_AL | 39 | 1SPI_CS | 19
- 1PWM_BH | 38 | GPIO | 18
- 1PWM_BL | 37 | 17
- 1PWM_CH | 36 | RESET | 16
- 1PWM_CL | 35 | 1SPI_SI | 15
- GPIO | 34 | 1SPI_SO | 14
- 33 | 1EN_GATE | 13
- PWM_DAC | 32 | 1DC_CAL | 12
- PWM_DAC | 31 | 11
- A
- Roy Yaung
- B
- I
- PWR
- GND
- 1.1
- CONNECTOR

## Sheet 6 of 7
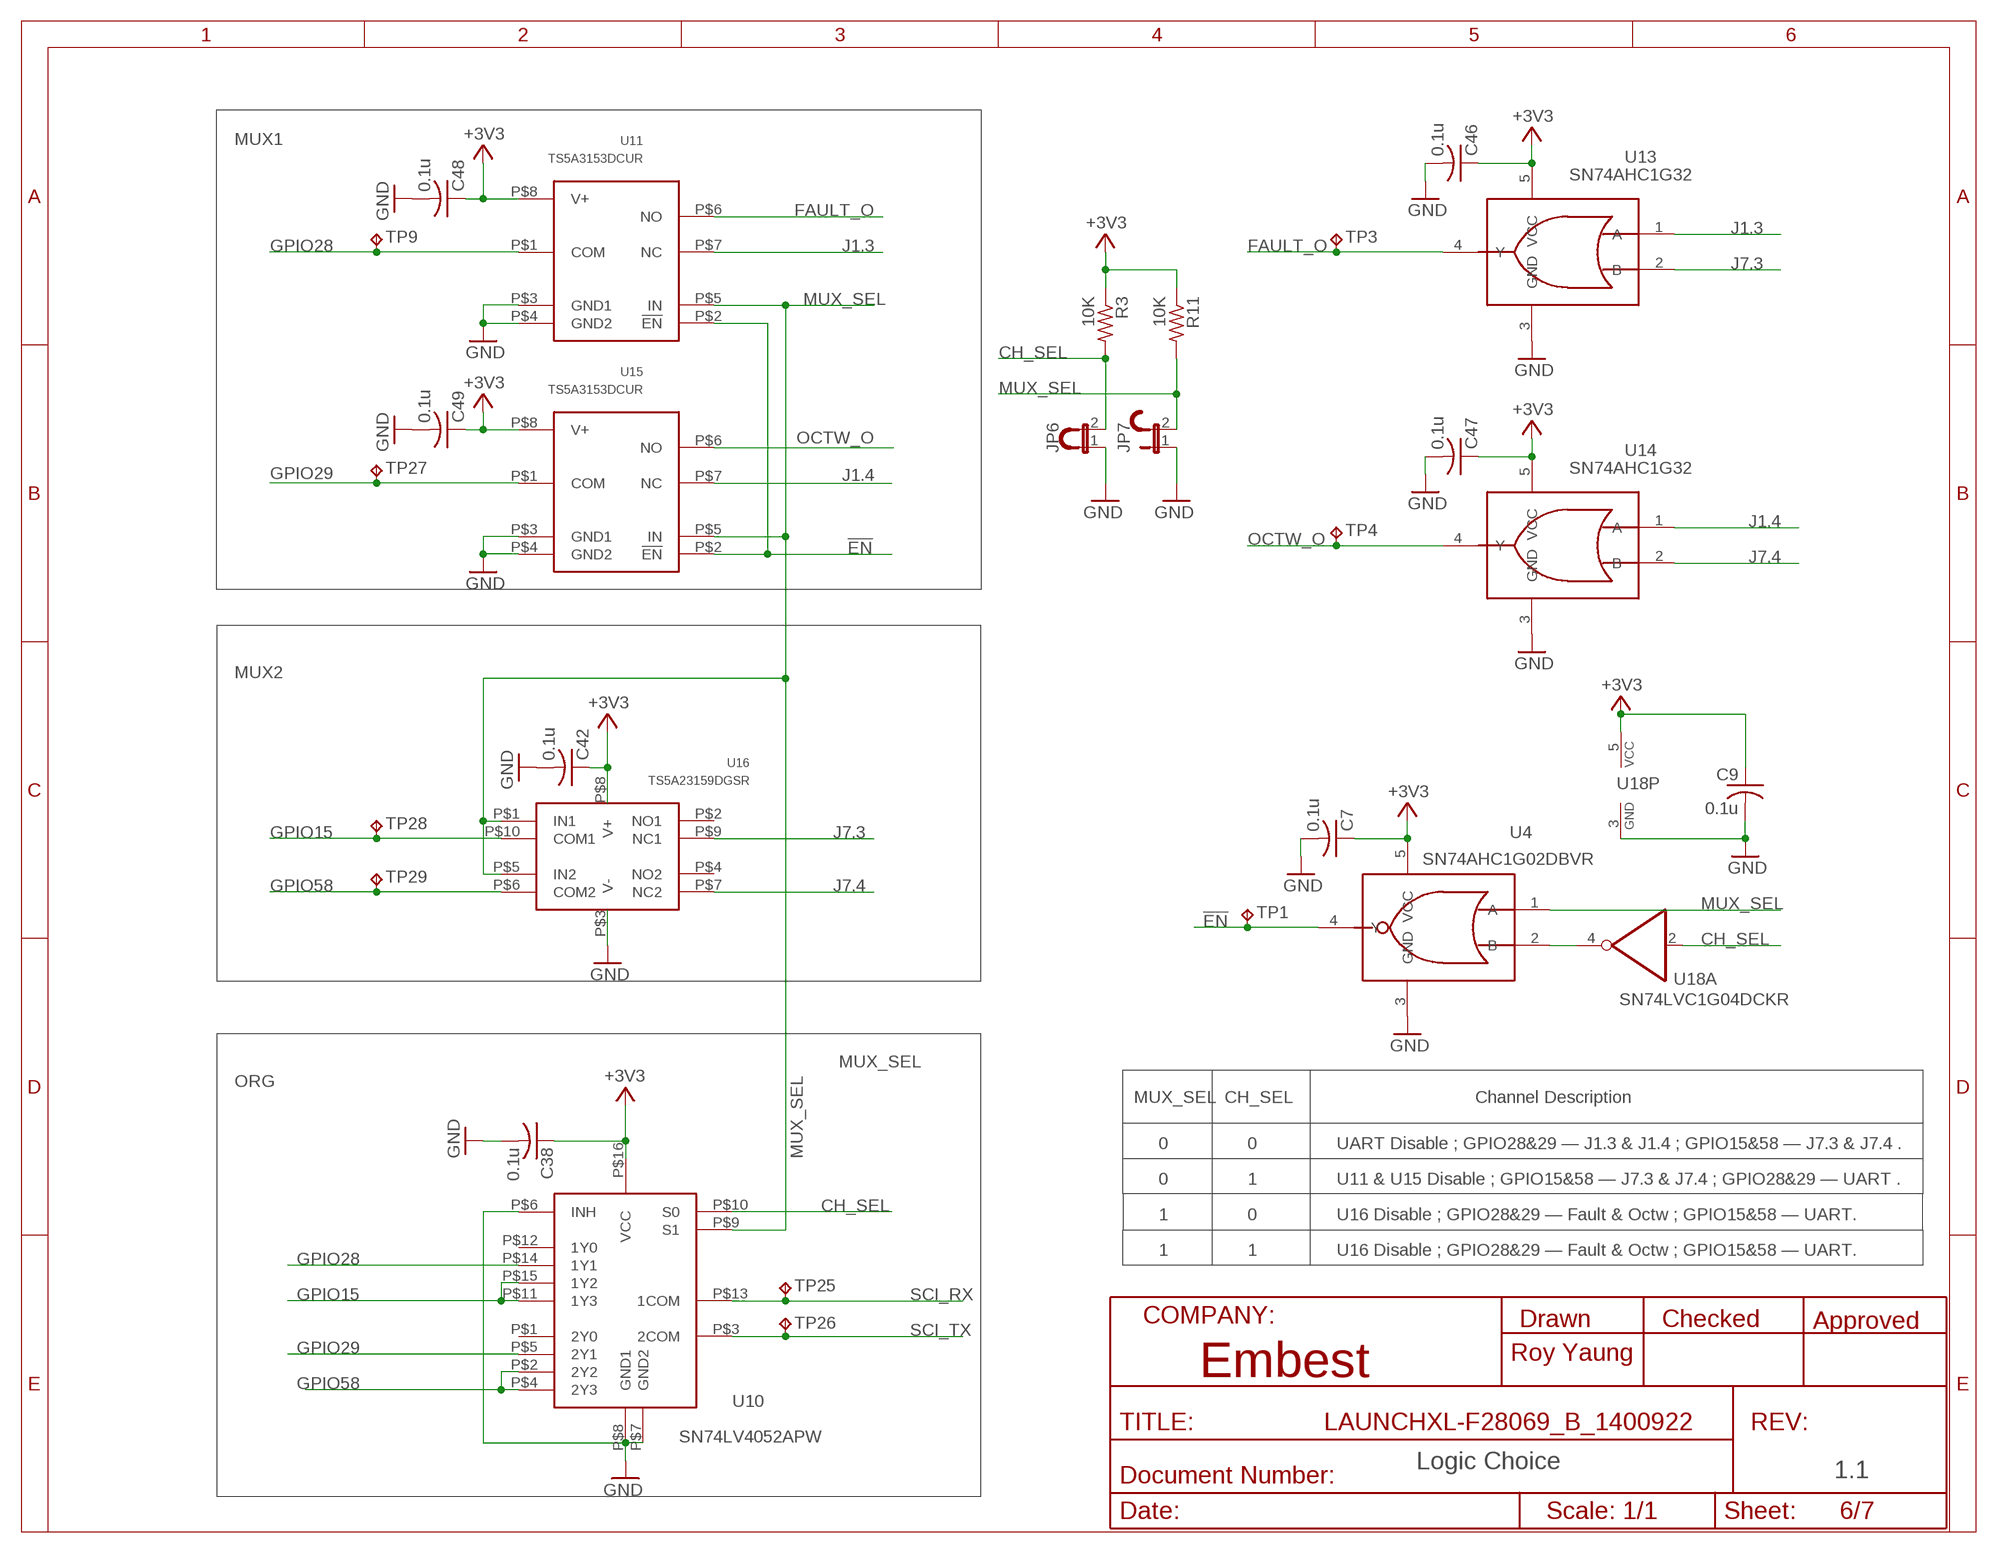
[diagram p5: schematic, sheet 6]

### Parts
C7  0.1u  C-USC0402  [C0402]
C9  0.1u  C-USC0402  [C0402]
C38  0.1u  C-USC0402  [C0402]
C42  0.1u  C-USC0402  [C0402]
C46  0.1u  C-USC0402  [C0402]
C47  0.1u  C-USC0402  [C0402]
C48  0.1u  C-USC0402  [C0402]
C49  0.1u  C-USC0402  [C0402]
JP6  JP1ENORM  [JP1]
JP7  JP1ENORM  [JP1]
R3  10K  R-US_R0402  [R0402]
R11  10K  R-US_R0402  [R0402]
TP1  TESTPAD_TPB1,27  [TESTPAD_B1,27]
TP3  TESTPAD_TPB1,27  [TESTPAD_B1,27]
TP4  TESTPAD_TPB1,27  [TESTPAD_B1,27]
TP9  TESTPAD_TPB1,27  [TESTPAD_B1,27]
TP25  TESTPAD_TPB1,27  [TESTPAD_B1,27]
TP26  TESTPAD_TPB1,27  [TESTPAD_B1,27]
TP27  TESTPAD_TPB1,27  [TESTPAD_B1,27]
TP28  TESTPAD_TPB1,27  [TESTPAD_B1,27]
TP29  TESTPAD_TPB1,27  [TESTPAD_B1,27]
U4  SN74AHC1G02DBVR  SN74AHC1G02  [SOT23-5-DBV]
U10  SN74LV4052APW  [TSSOP16-PW]
U11  TS5A3153DCUR  [TI-DCU8]
U13  SN74AHC1G32  [SOT23-5-DBV]
U14  SN74AHC1G32  [SOT23-5-DBV]
U15  TS5A3153DCUR  [TI-DCU8]
U16  TS5A23159DGSR  [TI-DGS10]
U18  SN74LVC1G04DCKR  74XX-LITTLE-DE_74AUC1G04DCK  [74XX-LITTLE-DE_SC70-5]
U$1  ROY_JUMPER  [ROY_JUMPER]
U$2  ROY_JUMPER  [ROY_JUMPER]

### Nets
!EN: TP1.TP U4.4(Y) U11.P$2(!EN) U15.P$2(!EN)
+3V3: C7.1 C9.1 C38.1 C42.1 C46.1 C47.1 C48.1 C49.1 R3.1 R11.1 U4.5(VCC) U10.P$16(VCC) U11.P$8(V+) U13.5(VCC) U14.5(VCC) U15.P$8(V+) U16.P$8(V+) U18.5(P:VCC) ; also sheet 2,3,4,5,7
CH_SEL: JP6.2 R3.2 U10.P$10(S0) U18.2(A:I)
FAULT_O: TP3.TP U11.P$6(NO) U13.4(Y)
GND: C7.2 C9.2 C38.2 C42.2 C46.2 C47.2 C48.2 C49.2 JP6.1 JP7.1 U4.3(GND) U10.P$6(INH) U10.P$7(GND2) U10.P$8(GND1) U11.P$3(GND1) U11.P$4(GND2) U13.3(GND) U14.3(GND) U15.P$3(GND1) U15.P$4(GND2) U16.P$3(V-) U18.3(P:GND) ; also sheet 2,3,4,5,7
GPIO15: TP28.TP U10.P$11(1Y3) U10.P$15(1Y2) U16.P$10(COM1) ; also sheet 4
GPIO28: TP9.TP U10.P$14(1Y1) U11.P$1(COM) ; also sheet 4
GPIO29: TP27.TP U10.P$5(2Y1) U15.P$1(COM) ; also sheet 4
GPIO58: TP29.TP U10.P$2(2Y2) U10.P$4(2Y3) U16.P$6(COM2) ; also sheet 4
J1.3: U11.P$7(NC) U13.1(A) ; also sheet 5
J1.4: U14.1(A) U15.P$7(NC) ; also sheet 5
J7.3: U13.2(B) U16.P$9(NC1) ; also sheet 5
J7.4: U14.2(B) U16.P$7(NC2) ; also sheet 5
MUX_SEL: JP7.2 R11.2 U4.1(A) U10.P$9(S1) U11.P$5(IN) U15.P$5(IN) U16.P$1(IN1) U16.P$5(IN2)
N$42: U4.2(B) U18.4(A:O)
OCTW_O: TP4.TP U14.4(Y) U15.P$6(NO)
SCI_RX: TP25.TP U10.P$13(1COM) ; also sheet 2
SCI_TX: TP26.TP U10.P$3(2COM) ; also sheet 2
Unconnected: U10.P$1(2Y0) U10.P$12(1Y0) U16.P$2(NO1) U16.P$4(NO2)

### Notes on the sheet
- MUX1
- MUX2
- ORG
- MUX_SEL | CH_SEL | Channel Description
- 0 | 0 | UART Disable ; GPIO28&29 — J1.3 & J1.4 ; GPIO15&58 — J7.3 & J7.4 .
- 0 | 1 | U11 & U15 Disable ; GPIO15&58 — J7.3 & J7.4 ; GPIO28&29 — UART .
- 1 | 0 | U16 Disable ; GPIO28&29 — Fault & Octw ; GPIO15&58 — UART.
- 1 | 1 | U16 Disable ; GPIO28&29 — Fault & Octw ; GPIO15&58 — UART.
- Roy Yaung
- Logic Choice
- 1.1

## Sheet 7 of 7
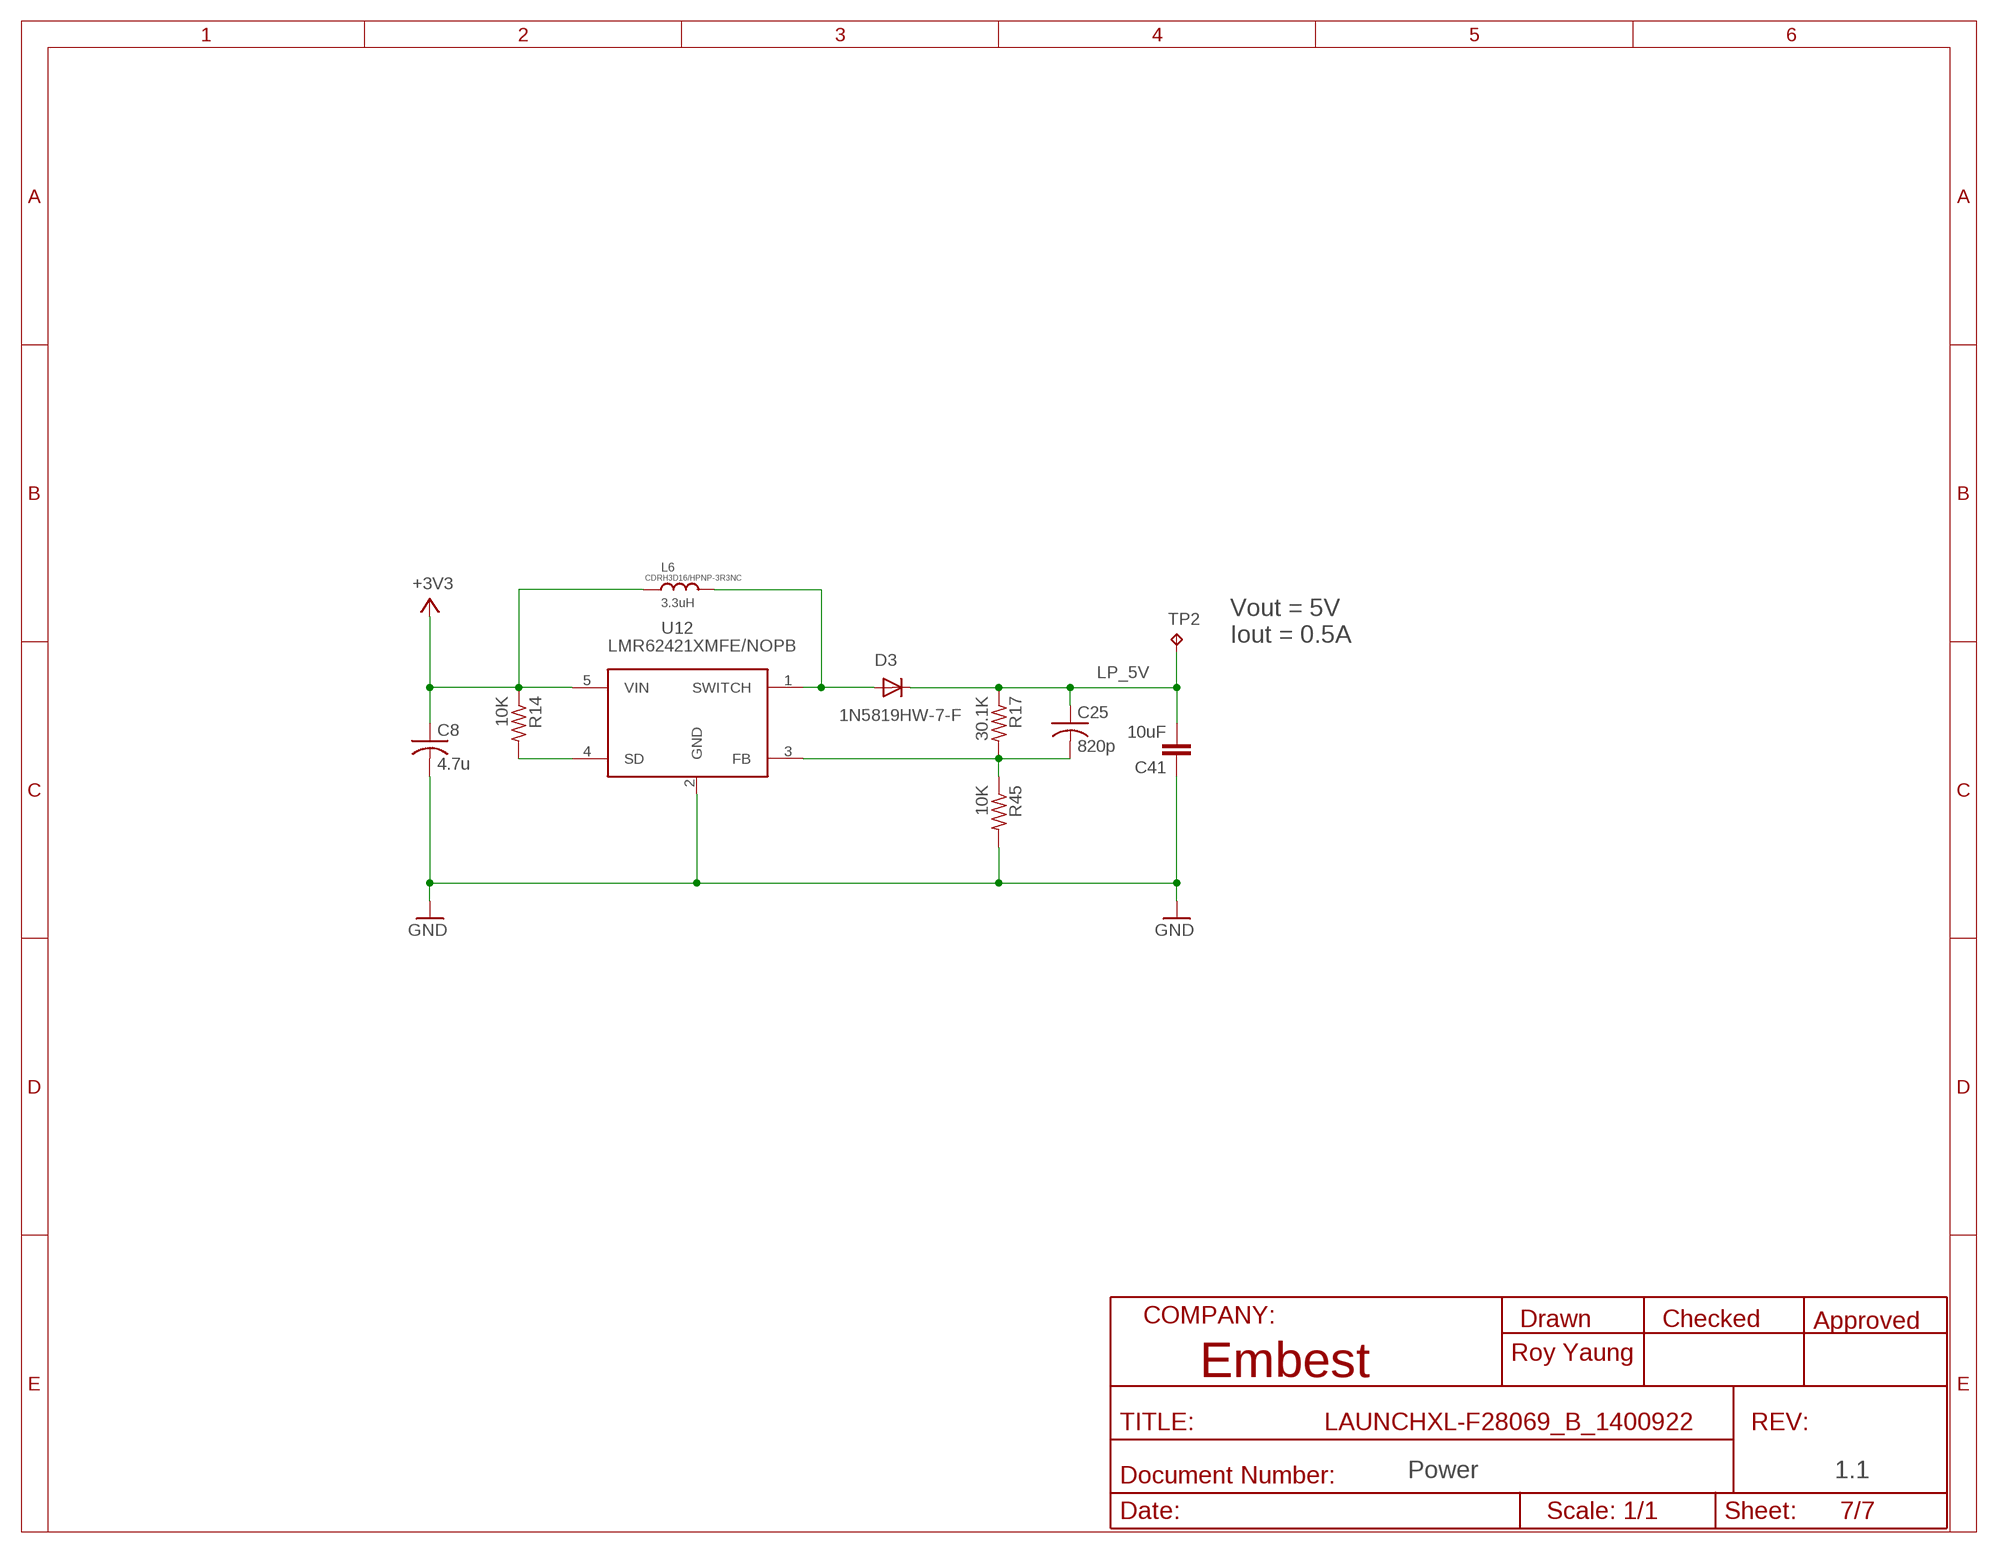
[diagram p6: schematic, sheet 7]

### Parts
C8  4.7u  C-USC0402  [C0402]
C25  820p  C-USC0402  [C0402]
C41  10uF  SPARKFUN_CAP1210  [SPARKFUN_1210]
D3  1N5819HW-7-F  1N4148  [SOD123]
L6  3.3uH  VLF4012A  [INDUCT-3_7*3_5]
R14  10K  R-US_R0402  [R0402]
R17  30.1K  R-US_R0402  [R0402]
R45  10K  R-US_R0402  [R0402]
TP2  TESTPAD_TPB1,27  [TESTPAD_B1,27]
U12  LMR62421XMFE/NOPB  [SOT23-5-DBV]

### Nets
+3V3: C8.1 L6.P$1 R14.1 U12.5(VIN) ; also sheet 2,3,4,5,6
GND: C8.2 C41.1 R45.2 U12.2(GND) ; also sheet 2,3,4,5,6
LP_5V: C25.1 C41.2 D3.C R17.1 TP2.TP ; also sheet 2
N$53: R14.2 U12.4(SD)
N$55: D3.A L6.P$2 U12.1(SWITCH)
N$56: C25.2 R17.2 R45.1 U12.3(FB)

### Notes on the sheet
- CDRH3D16/HPNP-3R3NC
- Vout = 5V
- Iout = 0.5A
- Roy Yaung
- Power | 1.1

## Library data of the parts
C1-C40 C42 C43 C46-C55 = rcl:C-US: CAPACITOR, American symbol
C41 C44 C45 = RF430FRL152H_EVM_a:SPARKFUN_CAP: Capacitor Standard 0603 ceramic capacitor, and 0.1" leaded capacitor.
CON1 = con-cypressindustries:MINI-USB-: MINI USB-B Conector Source: www.cypressindustries.com; OC_FARNELL: unknown; OC_NEWARK: unknown
D1 D4 D7-D10 = led:LED: LED OSRAM: - CHIPLED LG R971, LG N971, LY N971, LG Q971, LY Q971, LO R971, LY R971 LH N974, LH R974 LS Q976, LO Q976, LY Q976 LO Q996 - Hyper CHIPLED LW Q18S LB Q993, LB Q99A, LB R99A - SideLED LS A670, LO A670, LY A670, LG A670, LP A670 LB A673, LV A673, LT A673, LW A673 LH A674 LY A675 LS A676, LA A676, LO A676, LY A676, LW A676 LS A679, LY A679, LG A679 - Hyper Micro SIDELED® LS Y876, LA Y876, LO Y876, LY Y876 LT Y87S - SmartLED LW L88C, LW L88S LB L89C, LB L89S, LG L890 LS L89K, LO L89K, LY L89K LS L896, LA L896, LO L896, LY L896 - TOPLED LS T670, LO T670, LY T670, LG T670, LP T670 LSG T670, LSP T670, LSY T670, LOP T670, LYG T670 LG T671, LOG T671, LSG T671 LB T673, LV T673, LT T673, LW T673 LH T674 LS T676, LA T676, LO T676, LY T676, LB T676, LH T676, LSB T676, LW T676 LB T67C, LV T67C, LT T67C, LS T67K, LO T67K, LY T67K, LW E67C LS E67B, LA E67B, LO E67B, LY E67B, LB E67C, LV E67C, LT E67C LW T67C LS T679, LY T679, LG T679 LS T770, LO T770, LY T770, LG T770, LP T770 LB T773, LV T773, LT T773, LW T773 LH T774 LS E675, LA E675, LY E675, LS T675 LS T776, LA T776, LO T776, LY T776, LB T776 LHGB T686 LT T68C, LB T68C - Hyper Mini TOPLED® LB M676 - Mini TOPLED Santana® LG M470 LS M47K, LO M47K, LY M47K Source: http://www.osram.convergy.de LUXEON: - LUMILED® LXK2-PW12-R00, LXK2-PW12-S00, LXK2-PW14-U00, LXK2-PW14-V00 LXK2-PM12-R00, LXK2-PM12-S00, LXK2-PM14-U00 LXK2-PE12-Q00, LXK2-PE12-R00, LXK2-PE12-S00, LXK2-PE14-T00, LXK2-PE14-U00 LXK2-PB12-K00, LXK2-PB12-L00, LXK2-PB12-M00, LXK2-PB14-N00, LXK2-PB14-P00, LXK2-PB14-Q00 LXK2-PR12-L00, LXK2-PR12-M00, LXK2-PR14-Q00, LXK2-PR14-R00 LXK2-PD12-Q00, LXK2-PD12-R00, LXK2-PD12-S00 LXK2-PH12-R00, LXK2-PH12-S00 LXK2-PL12-P00, LXK2-PL12-Q00, LXK2-PL12-R00 Source: www.luxeon.com KINGBRIGHT: KA-3528ASYC Source: www.kingbright.com
D3 = diode:1N4148: DIODE high speed (Philips)
F1 = rcl:L-EU: INDUCTOR, European symbol
J1-J8 = con-lstb:MA10-1: PIN HEADER; OC_FARNELL: unknown; OC_NEWARK: unknown
J9 = LAUNCHXL-F28027:CON-LSTB_MA03-1: PIN HEADER; OC_FARNELL: unknown; OC_NEWARK: unknown
J12 = con-lstb:MA03-1: PIN HEADER; OC_FARNELL: unknown; OC_NEWARK: unknown
JP1-JP7 = jumper:JP1E: JUMPER
L1-L4 = rcl:L-US: INDUCTOR, American symbol
L6 L7 = LAUNCHXL-F28027:VLF4012A
Q1 = crystal:CRYSTAL: CRYSTAL; OC_FARNELL: 1667008; OC_NEWARK: unknown
Q3 = crystal:CRYSTAL: CRYSTAL; OC_FARNELL: unknown; OC_NEWARK: unknown
QEP_A QEP_B = con-lstb:MA05-1: PIN HEADER; OC_FARNELL: unknown; OC_NEWARK: unknown
R1-R51 = rcl:R-US_: RESISTOR, American symbol
S1 = switch-dil:219-03*: Surface Mount DIP Switch Series 219 SMT CTS Electronic Components Sourc: www.ctscorp.com; OC_FARNELL: unknown; OC_NEWARK: unknown
S2 = switch:FSMJSMA
TP1-TP30 = RF430FRL152H_EVM_a:TESTPAD_TP: Test pad
U1 = LAUNCHXL-F28027:TMS320F28069PZS
U2 = LAUNCHXL-F28027:TXB0106PWR
U3 = LAUNCHXL-F28027:SN65HVD234D
U4 = LAUNCHXL-F28027:SN74AHC1G02
U5 = texas:ISO7240: HIGH SPEED QUAD DIGITAL ISOLATORS Source: http://focus.ti.com/lit/ds/symlink/iso7240m.pdf; MPN: ISO7240MDW; OC_FARNELL: 1755124; OC_NEWARK: 58M0385
U6 = ti_trey:FT2232H
U7 = texas:ISO7231
U8 = ti_trey:93*: Serial EPROM 1 K/2 K/4 K, low voltage, Microwire
U9 = texas:SN74LVC2G07
U10 = LAUNCHXL-F28027:SN74LV4052APW
U11 U15 = LAUNCHXL-F28027:TS5A3153DCUR
U12 = LAUNCHXL-F28027:LMR62421XMFE/NOPB
U13 U14 = LAUNCHXL-F28027:SN74AHC1G32
U16 = LAUNCHXL-F28027:TS5A23159DGSR
U17 = LAUNCHXL-F28027:TPS62162DSGR
U18 = RF430FRL152H_EVM_a:74XX-LITTLE-DE_74*1G04: INVERTER Gate
U$1 U$2 U$9-U$13 = roy:ROY_JUMPER

## Net classes
0 default: width 0.152 mm, drill 0.305 mm, clearance 0.152 mm